# Altium project Hydra A1 UCLO 35131D.PrjPCB (part 7 of 14)

## Sheet A1-A1 Switches new.SchDoc: A1-A1 Switches new
size D; DrawnBy: C. Lewis; Engineer: C. Lewis; Address1: 4650 NORRIS CANYON RD.; Address2: SAN RAMON, CA 94583; DocumentNumber: 35133; Revision: D; SheetNumber: 2; SheetTotal: 20
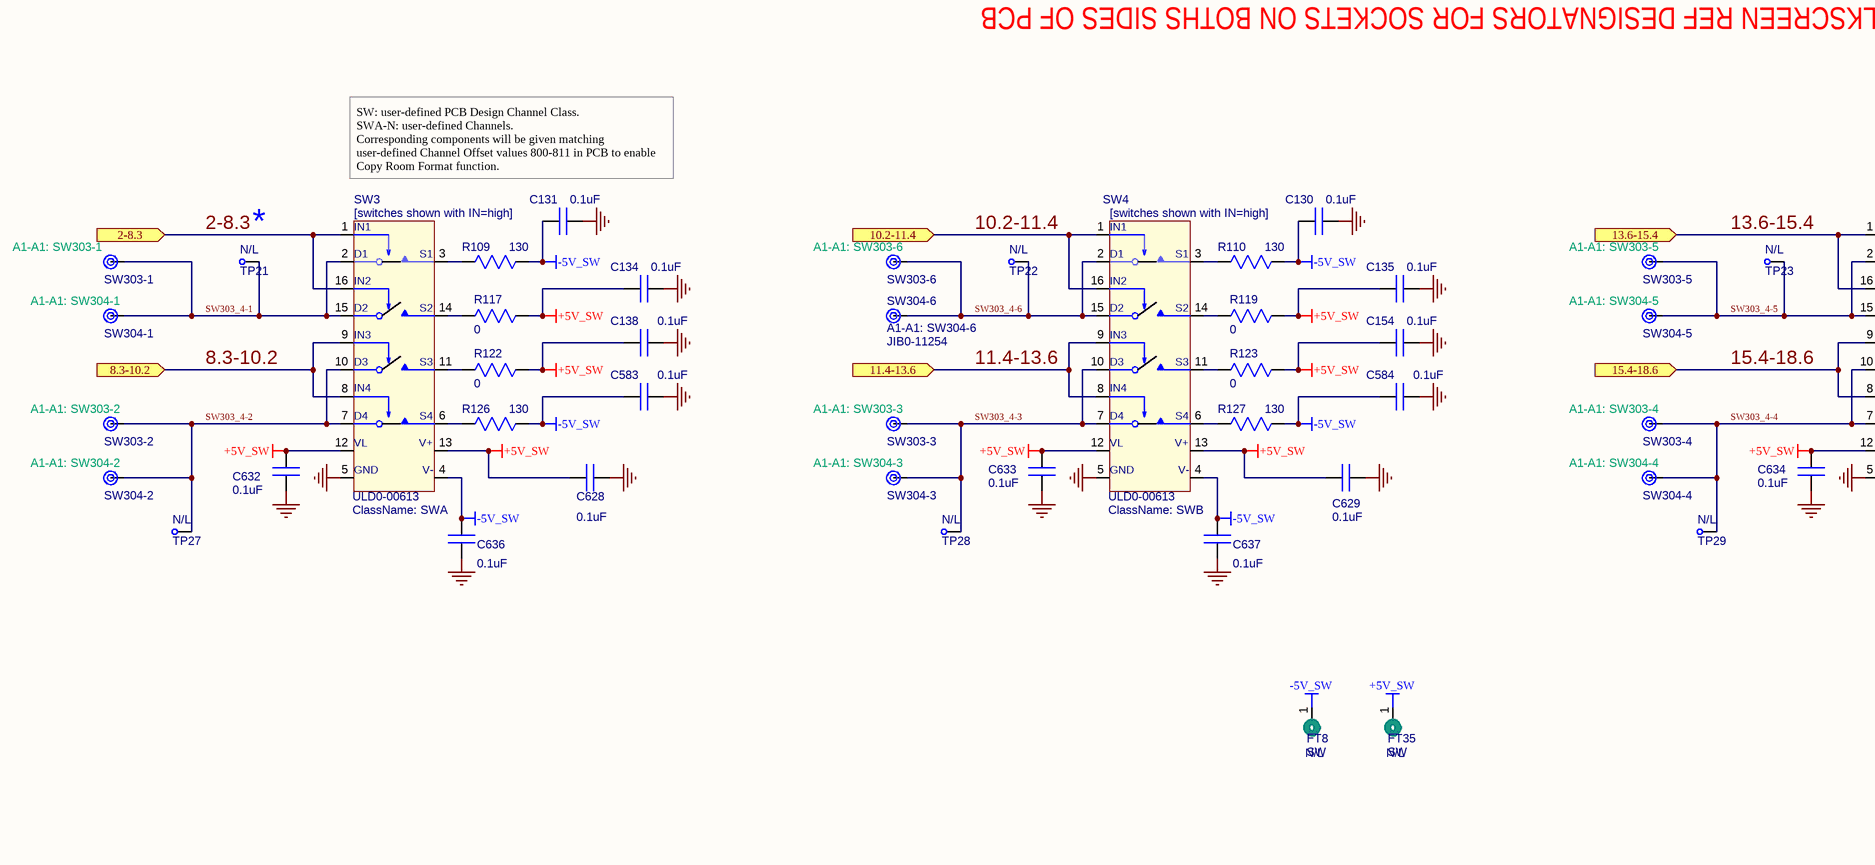
[diagram p33: A1-A1 Switches new.SchDoc, top left]
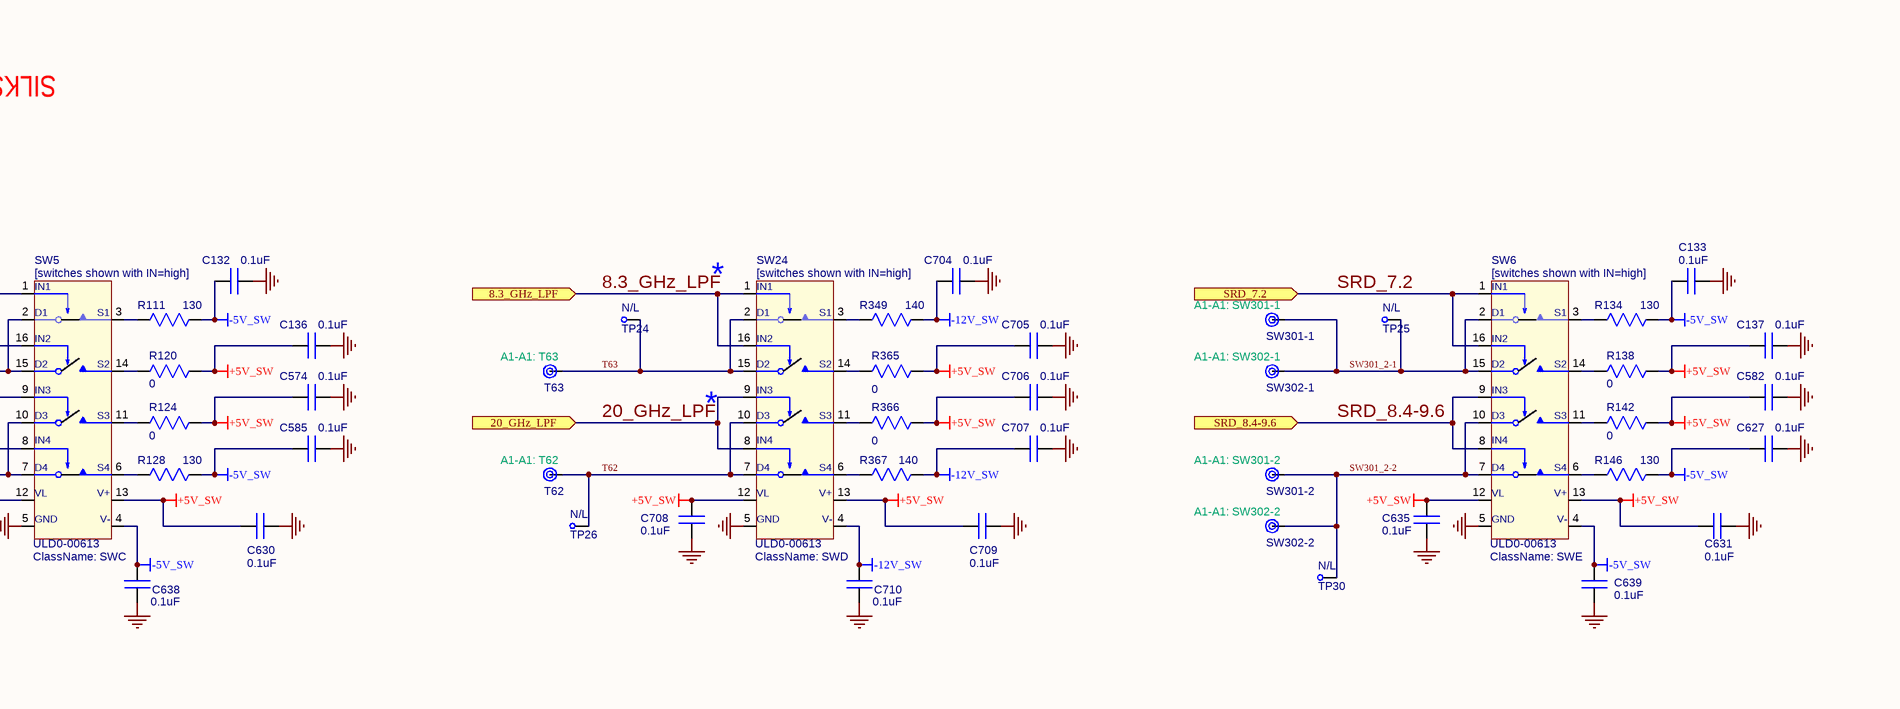
[diagram p34: A1-A1 Switches new.SchDoc, top right]
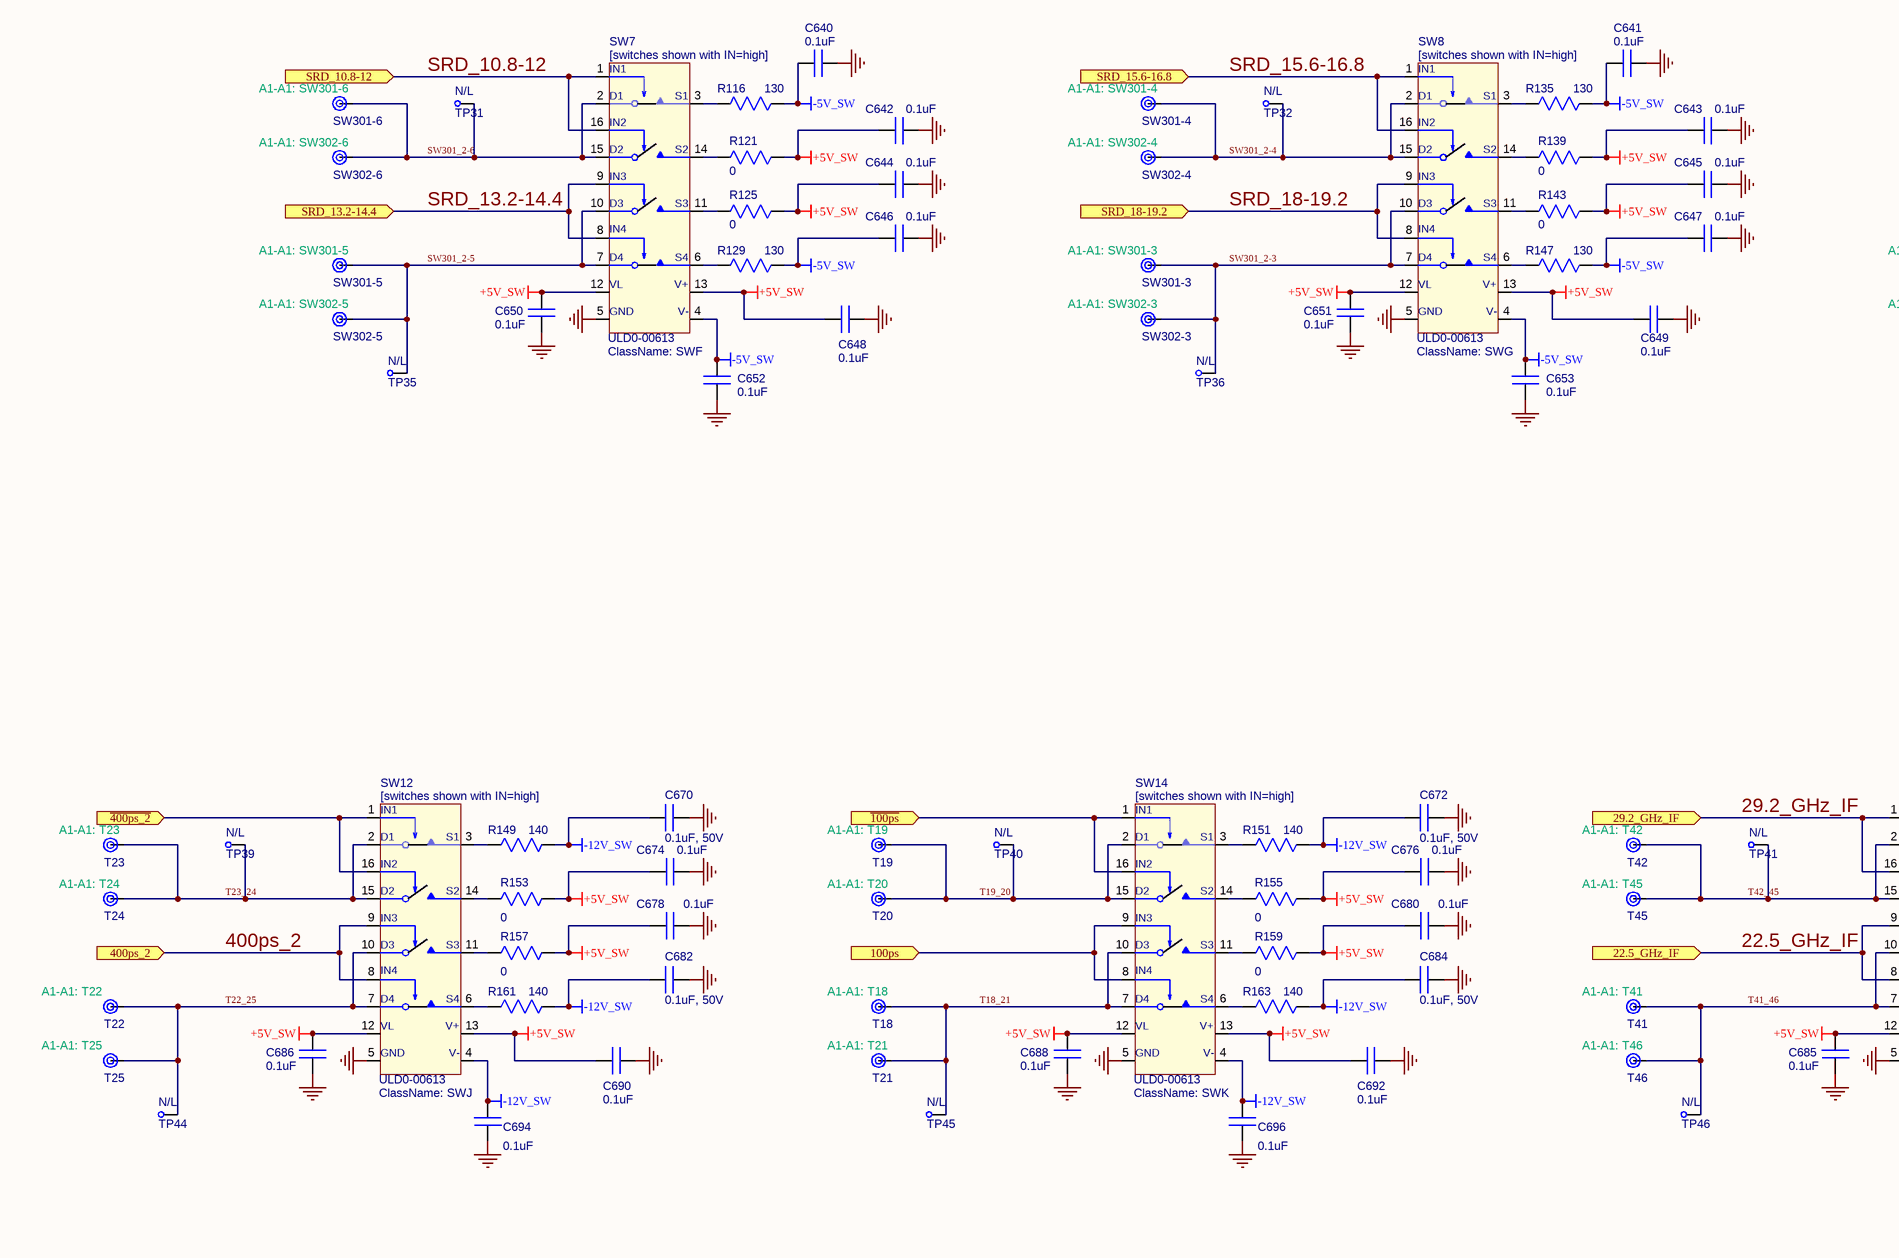
[diagram p35: A1-A1 Switches new.SchDoc, bottom left]
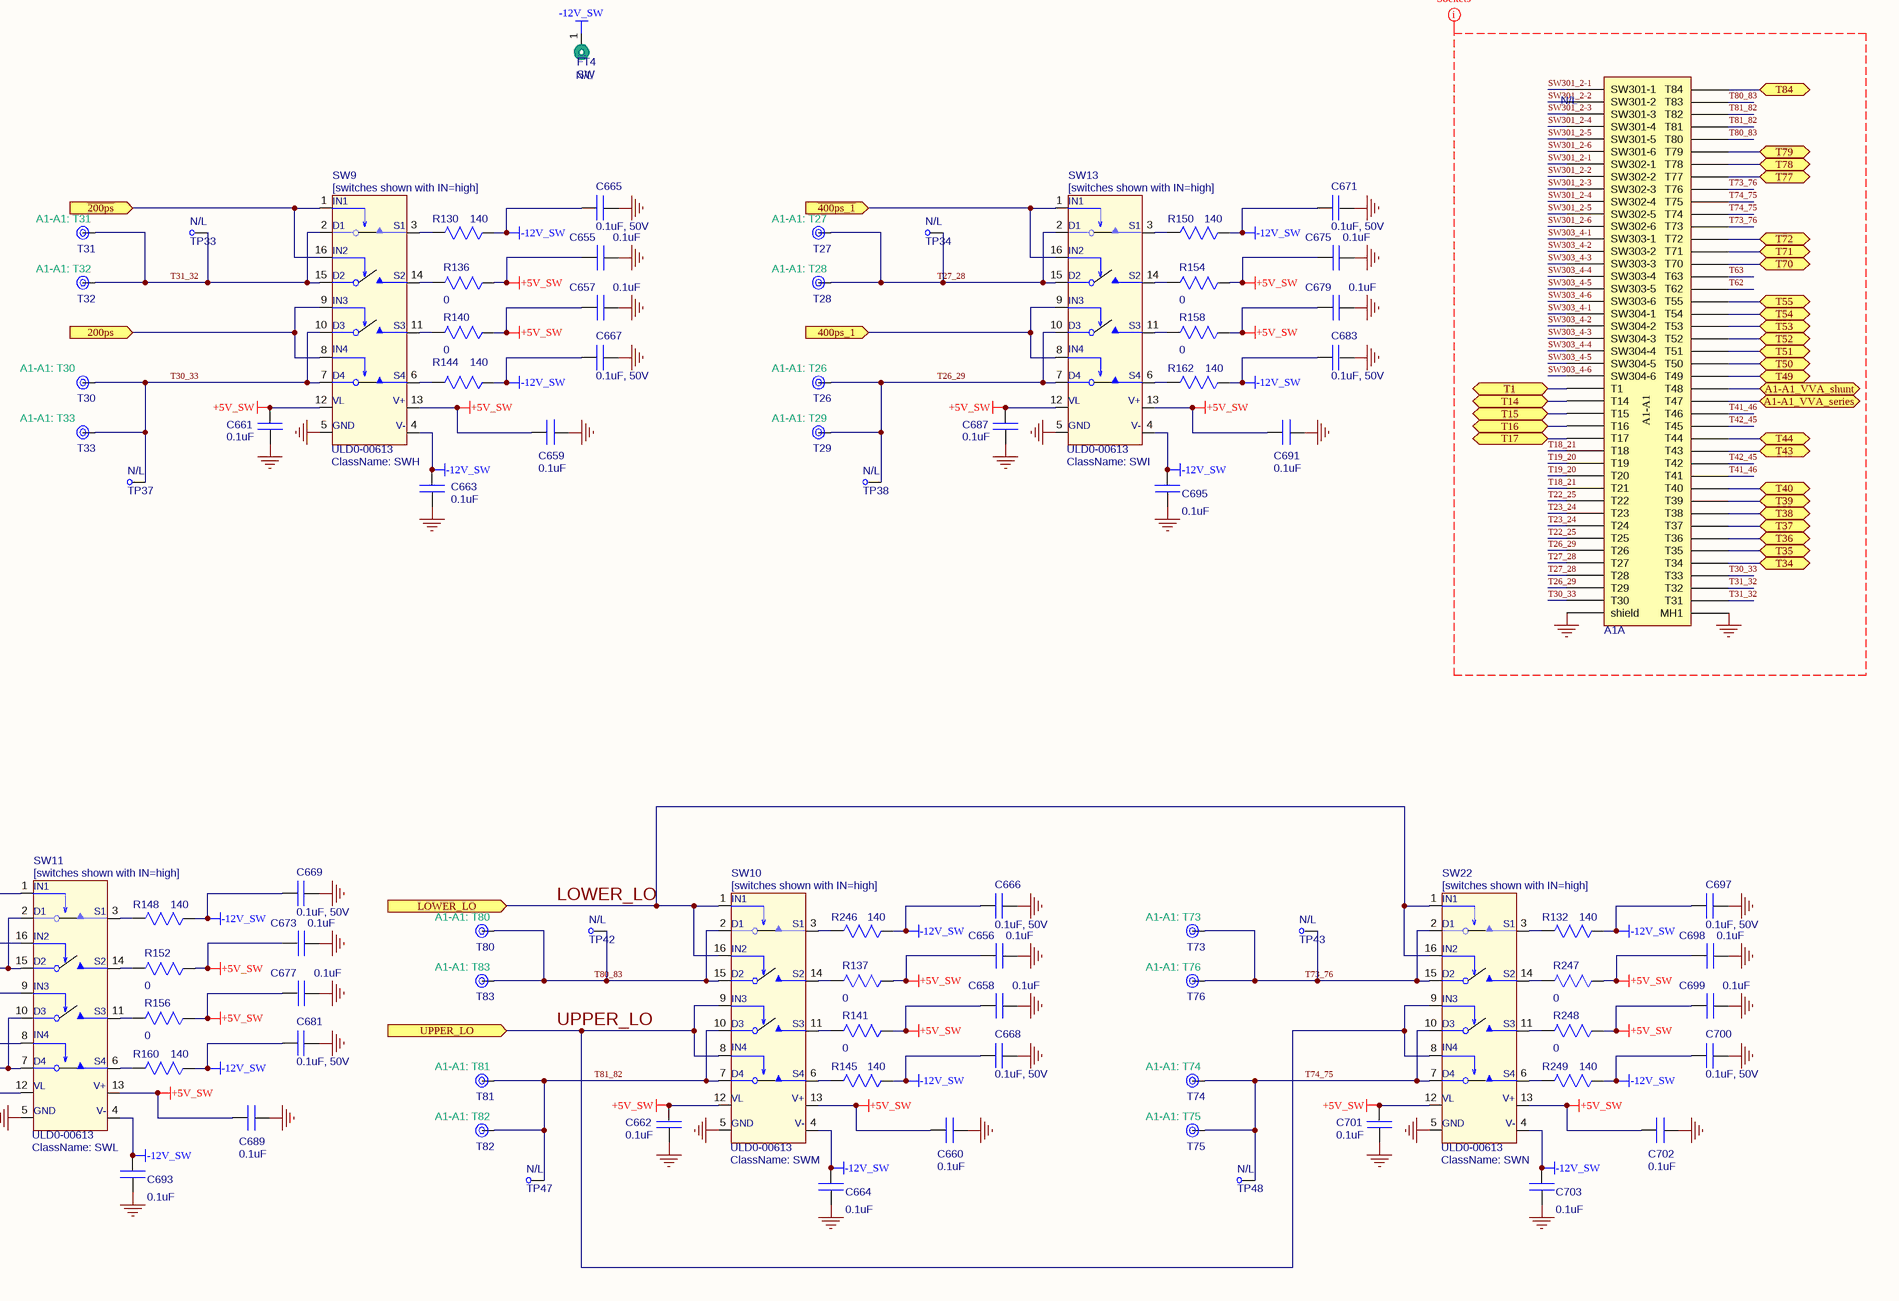
[diagram p36: A1-A1 Switches new.SchDoc, bottom right]

### Parts
A1  NoLoad: N/L  [Hydra_A1_output_modules]  (hidden comment: PCB features)  (part A of 2)
C130  value 0.1uF  [CAP-0402-N]  (hidden comment: .1 UF,10%;X7R;16V,CHIP;0402)
C131  value 0.1uF  [CAP-0402-N]  (hidden comment: .1 UF,10%;X7R;16V,CHIP;0402)
C132  value 0.1uF  [CAP-0402-N]  (hidden comment: .1 UF,10%;X7R;16V,CHIP;0402)
C133  value 0.1uF  [CAP-0402-N]  (hidden comment: .1 UF,10%;X7R;16V,CHIP;0402)
C134  value 0.1uF  [CAP-0402-N]  (hidden comment: .1 UF,10%;X7R;16V,CHIP;0402)
C135  value 0.1uF  [CAP-0402-N]  (hidden comment: .1 UF,10%;X7R;16V,CHIP;0402)
C136  value 0.1uF  [CAP-0402-N]  (hidden comment: .1 UF,10%;X7R;16V,CHIP;0402)
C137  value 0.1uF  [CAP-0402-N]  (hidden comment: .1 UF,10%;X7R;16V,CHIP;0402)
C138  value 0.1uF  [CAP-0402-N]  (hidden comment: .1 UF,10%;X7R;16V,CHIP;0402)
C154  value 0.1uF  [CAP-0402-N]  (hidden comment: .1 UF,10%;X7R;16V,CHIP;0402)
C574  value 0.1uF  [CAP-0402-N]  (hidden comment: .1 UF,10%;X7R;16V,CHIP;0402)
C582  value 0.1uF  [CAP-0402-N]  (hidden comment: .1 UF,10%;X7R;16V,CHIP;0402)
C583  value 0.1uF  [CAP-0402-N]  (hidden comment: .1 UF,10%;X7R;16V,CHIP;0402)
C584  value 0.1uF  [CAP-0402-N]  (hidden comment: .1 UF,10%;X7R;16V,CHIP;0402)
C585  value 0.1uF  [CAP-0402-N]  (hidden comment: .1 UF,10%;X7R;16V,CHIP;0402)
C627  value 0.1uF  [CAP-0402-N]  (hidden comment: .1 UF,10%;X7R;16V,CHIP;0402)
C628  value 0.1uF  [CAP-0402-N]  (hidden comment: .1 UF,10%;X7R;16V,CHIP;0402)
C629  value 0.1uF  [CAP-0402-N]  (hidden comment: .1 UF,10%;X7R;16V,CHIP;0402)
C630  value 0.1uF  [CAP-0402-N]  (hidden comment: .1 UF,10%;X7R;16V,CHIP;0402)
C631  value 0.1uF  [CAP-0402-N]  (hidden comment: .1 UF,10%;X7R;16V,CHIP;0402)
C632  value 0.1uF  [CAP-0402-N]  (hidden comment: .1 UF,10%;X7R;16V,CHIP;0402)
C633  value 0.1uF  [CAP-0402-N]  (hidden comment: .1 UF,10%;X7R;16V,CHIP;0402)
C634  value 0.1uF  [CAP-0402-N]  (hidden comment: .1 UF,10%;X7R;16V,CHIP;0402)
C635  value 0.1uF  [CAP-0402-N]  (hidden comment: .1 UF,10%;X7R;16V,CHIP;0402)
C636  value 0.1uF  [CAP-0402-N]  (hidden comment: .1 UF,10%;X7R;16V,CHIP;0402)
C637  value 0.1uF  [CAP-0402-N]  (hidden comment: .1 UF,10%;X7R;16V,CHIP;0402)
C638  value 0.1uF  [CAP-0402-N]  (hidden comment: .1 UF,10%;X7R;16V,CHIP;0402)
C639  value 0.1uF  [CAP-0402-N]  (hidden comment: .1 UF,10%;X7R;16V,CHIP;0402)
C640  value 0.1uF  [CAP-0402-N]  (hidden comment: .1 UF,10%;X7R;16V,CHIP;0402)
C641  value 0.1uF  [CAP-0402-N]  (hidden comment: .1 UF,10%;X7R;16V,CHIP;0402)
C642  value 0.1uF  [CAP-0402-N]  (hidden comment: .1 UF,10%;X7R;16V,CHIP;0402)
C643  value 0.1uF  [CAP-0402-N]  (hidden comment: .1 UF,10%;X7R;16V,CHIP;0402)
C644  value 0.1uF  [CAP-0402-N]  (hidden comment: .1 UF,10%;X7R;16V,CHIP;0402)
C645  value 0.1uF  [CAP-0402-N]  (hidden comment: .1 UF,10%;X7R;16V,CHIP;0402)
C646  value 0.1uF  [CAP-0402-N]  (hidden comment: .1 UF,10%;X7R;16V,CHIP;0402)
C647  value 0.1uF  [CAP-0402-N]  (hidden comment: .1 UF,10%;X7R;16V,CHIP;0402)
C648  value 0.1uF  [CAP-0402-N]  (hidden comment: .1 UF,10%;X7R;16V,CHIP;0402)
C649  value 0.1uF  [CAP-0402-N]  (hidden comment: .1 UF,10%;X7R;16V,CHIP;0402)
C650  value 0.1uF  [CAP-0402-N]  (hidden comment: .1 UF,10%;X7R;16V,CHIP;0402)
C651  value 0.1uF  [CAP-0402-N]  (hidden comment: .1 UF,10%;X7R;16V,CHIP;0402)
C652  value 0.1uF  [CAP-0402-N]  (hidden comment: .1 UF,10%;X7R;16V,CHIP;0402)
C653  value 0.1uF  [CAP-0402-N]  (hidden comment: .1 UF,10%;X7R;16V,CHIP;0402)
C655  value 0.1uF  [CAP-0402-N]  (hidden comment: .1 UF,10%;X7R;16V,CHIP;0402)
C656  value 0.1uF  [CAP-0402-N]  (hidden comment: .1 UF,10%;X7R;16V,CHIP;0402)
C657  value 0.1uF  [CAP-0402-N]  (hidden comment: .1 UF,10%;X7R;16V,CHIP;0402)
C658  value 0.1uF  [CAP-0402-N]  (hidden comment: .1 UF,10%;X7R;16V,CHIP;0402)
C659  value 0.1uF  [CAP-0402-N]  (hidden comment: .1 UF,10%;X7R;16V,CHIP;0402)
C660  value 0.1uF  [CAP-0402-N]  (hidden comment: .1 UF,10%;X7R;16V,CHIP;0402)
C661  value 0.1uF  [CAP-0402-N]  (hidden comment: .1 UF,10%;X7R;16V,CHIP;0402)
C662  value 0.1uF  [CAP-0402-N]  (hidden comment: .1 UF,10%;X7R;16V,CHIP;0402)
C663  value 0.1uF  [CAP-0402-N]  (hidden comment: .1 UF,10%;X7R;16V,CHIP;0402)
C664  value 0.1uF  [CAP-0402-N]  (hidden comment: .1 UF,10%;X7R;16V,CHIP;0402)
C665  value 0.1uF, 50V  [CAP-0603-N]  (hidden comment: .1UF;5%;X7R;50V;CHIP;0603)
C666  value 0.1uF, 50V  [CAP-0603-N]  (hidden comment: .1UF;5%;X7R;50V;CHIP;0603)
C667  value 0.1uF, 50V  [CAP-0603-N]  (hidden comment: .1UF;5%;X7R;50V;CHIP;0603)
C668  value 0.1uF, 50V  [CAP-0603-N]  (hidden comment: .1UF;5%;X7R;50V;CHIP;0603)
C669  value 0.1uF, 50V  [CAP-0603-N]  (hidden comment: .1UF;5%;X7R;50V;CHIP;0603)
C670  value 0.1uF, 50V  [CAP-0603-N]  (hidden comment: .1UF;5%;X7R;50V;CHIP;0603)
C671  value 0.1uF, 50V  [CAP-0603-N]  (hidden comment: .1UF;5%;X7R;50V;CHIP;0603)
C672  value 0.1uF, 50V  [CAP-0603-N]  (hidden comment: .1UF;5%;X7R;50V;CHIP;0603)
C673  value 0.1uF  [CAP-0402-N]  (hidden comment: .1 UF,10%;X7R;16V,CHIP;0402)
C674  value 0.1uF  [CAP-0402-N]  (hidden comment: .1 UF,10%;X7R;16V,CHIP;0402)
C675  value 0.1uF  [CAP-0402-N]  (hidden comment: .1 UF,10%;X7R;16V,CHIP;0402)
C676  value 0.1uF  [CAP-0402-N]  (hidden comment: .1 UF,10%;X7R;16V,CHIP;0402)
C677  value 0.1uF  [CAP-0402-N]  (hidden comment: .1 UF,10%;X7R;16V,CHIP;0402)
C678  value 0.1uF  [CAP-0402-N]  (hidden comment: .1 UF,10%;X7R;16V,CHIP;0402)
C679  value 0.1uF  [CAP-0402-N]  (hidden comment: .1 UF,10%;X7R;16V,CHIP;0402)
C680  value 0.1uF  [CAP-0402-N]  (hidden comment: .1 UF,10%;X7R;16V,CHIP;0402)
C681  value 0.1uF, 50V  [CAP-0603-N]  (hidden comment: .1UF;5%;X7R;50V;CHIP;0603)
C682  value 0.1uF, 50V  [CAP-0603-N]  (hidden comment: .1UF;5%;X7R;50V;CHIP;0603)
C683  value 0.1uF, 50V  [CAP-0603-N]  (hidden comment: .1UF;5%;X7R;50V;CHIP;0603)
C684  value 0.1uF, 50V  [CAP-0603-N]  (hidden comment: .1UF;5%;X7R;50V;CHIP;0603)
C685  value 0.1uF  [CAP-0402-N]  (hidden comment: .1 UF,10%;X7R;16V,CHIP;0402)
C686  value 0.1uF  [CAP-0402-N]  (hidden comment: .1 UF,10%;X7R;16V,CHIP;0402)
C687  value 0.1uF  [CAP-0402-N]  (hidden comment: .1 UF,10%;X7R;16V,CHIP;0402)
C688  value 0.1uF  [CAP-0402-N]  (hidden comment: .1 UF,10%;X7R;16V,CHIP;0402)
C689  value 0.1uF  [CAP-0402-N]  (hidden comment: .1 UF,10%;X7R;16V,CHIP;0402)
C690  value 0.1uF  [CAP-0402-N]  (hidden comment: .1 UF,10%;X7R;16V,CHIP;0402)
C691  value 0.1uF  [CAP-0402-N]  (hidden comment: .1 UF,10%;X7R;16V,CHIP;0402)
C692  value 0.1uF  [CAP-0402-N]  (hidden comment: .1 UF,10%;X7R;16V,CHIP;0402)
C693  value 0.1uF  [CAP-0402-N]  (hidden comment: .1 UF,10%;X7R;16V,CHIP;0402)
C694  value 0.1uF  [CAP-0402-N]  (hidden comment: .1 UF,10%;X7R;16V,CHIP;0402)
C695  value 0.1uF  [CAP-0402-N]  (hidden comment: .1 UF,10%;X7R;16V,CHIP;0402)
C696  value 0.1uF  [CAP-0402-N]  (hidden comment: .1 UF,10%;X7R;16V,CHIP;0402)
C697  value 0.1uF, 50V  [CAP-0603-N]  (hidden comment: .1UF;5%;X7R;50V;CHIP;0603)
C698  value 0.1uF  [CAP-0402-N]  (hidden comment: .1 UF,10%;X7R;16V,CHIP;0402)
C699  value 0.1uF  [CAP-0402-N]  (hidden comment: .1 UF,10%;X7R;16V,CHIP;0402)
C700  value 0.1uF, 50V  [CAP-0603-N]  (hidden comment: .1UF;5%;X7R;50V;CHIP;0603)
C701  value 0.1uF  [CAP-0402-N]  (hidden comment: .1 UF,10%;X7R;16V,CHIP;0402)
C702  value 0.1uF  [CAP-0402-N]  (hidden comment: .1 UF,10%;X7R;16V,CHIP;0402)
C703  value 0.1uF  [CAP-0402-N]  (hidden comment: .1 UF,10%;X7R;16V,CHIP;0402)
C704  value 0.1uF  [CAP-0402-N]  (hidden comment: .1 UF,10%;X7R;16V,CHIP;0402)
C705  value 0.1uF  [CAP-0402-N]  (hidden comment: .1 UF,10%;X7R;16V,CHIP;0402)
C706  value 0.1uF  [CAP-0402-N]  (hidden comment: .1 UF,10%;X7R;16V,CHIP;0402)
C707  value 0.1uF  [CAP-0402-N]  (hidden comment: .1 UF,10%;X7R;16V,CHIP;0402)
C708  value 0.1uF  [CAP-0402-N]  (hidden comment: .1 UF,10%;X7R;16V,CHIP;0402)
C709  value 0.1uF  [CAP-0402-N]  (hidden comment: .1 UF,10%;X7R;16V,CHIP;0402)
C710  value 0.1uF  [CAP-0402-N]  (hidden comment: .1 UF,10%;X7R;16V,CHIP;0402)
FT4  SW  NoLoad: N/L  [FromToNode_ML2]  (net tie, no BOM)
FT8  SW  NoLoad: N/L  [FromToNode_ML2]  (net tie, no BOM)
FT35  SW  NoLoad: N/L  [FromToNode_ML2]  (net tie, no BOM)
R109  value 130  [RES-0603-N]  (hidden comment: 130 OHMS;.1W;1%;200PPM;FILM;CHIP;0603)
R110  value 130  [RES-0603-N]  (hidden comment: 130 OHMS;.1W;1%;200PPM;FILM;CHIP;0603)
R111  value 130  [RES-0603-N]  (hidden comment: 130 OHMS;.1W;1%;200PPM;FILM;CHIP;0603)
R116  value 130  [RES-0603-N]  (hidden comment: 130 OHMS;.1W;1%;200PPM;FILM;CHIP;0603)
R117  value 0  [RES-0603-N]  (hidden comment: JUMPER;.05 OHMS MAX;1A MAX;0603)
R119  value 0  [RES-0603-N]  (hidden comment: JUMPER;.05 OHMS MAX;1A MAX;0603)
R120  value 0  [RES-0603-N]  (hidden comment: JUMPER;.05 OHMS MAX;1A MAX;0603)
R121  value 0  [RES-0603-N]  (hidden comment: JUMPER;.05 OHMS MAX;1A MAX;0603)
R122  value 0  [RES-0603-N]  (hidden comment: JUMPER;.05 OHMS MAX;1A MAX;0603)
R123  value 0  [RES-0603-N]  (hidden comment: JUMPER;.05 OHMS MAX;1A MAX;0603)
R124  value 0  [RES-0603-N]  (hidden comment: JUMPER;.05 OHMS MAX;1A MAX;0603)
R125  value 0  [RES-0603-N]  (hidden comment: JUMPER;.05 OHMS MAX;1A MAX;0603)
R126  value 130  [RES-0603-N]  (hidden comment: 130 OHMS;.1W;1%;200PPM;FILM;CHIP;0603)
R127  value 130  [RES-0603-N]  (hidden comment: 130 OHMS;.1W;1%;200PPM;FILM;CHIP;0603)
R128  value 130  [RES-0603-N]  (hidden comment: 130 OHMS;.1W;1%;200PPM;FILM;CHIP;0603)
R129  value 130  [RES-0603-N]  (hidden comment: 130 OHMS;.1W;1%;200PPM;FILM;CHIP;0603)
R130  value 140  [RES-0603-N]  (hidden comment: 140 OHMS;.1W;1%;200PPM;FILM;CHIP;0603)
R132  value 140  [RES-0402-N]  (hidden comment: 140 OHMS; 1%; .1W; 100PPM; FILM; CHIP; 0402)
R134  value 130  [RES-0603-N]  (hidden comment: 130 OHMS;.1W;1%;200PPM;FILM;CHIP;0603)
R135  value 130  [RES-0603-N]  (hidden comment: 130 OHMS;.1W;1%;200PPM;FILM;CHIP;0603)
R136  value 0  [RES-0402-N]  (hidden comment: JUMPER;0 OHMS;SMT;0402)
R137  value 0  [RES-0402-N]  (hidden comment: JUMPER;0 OHMS;SMT;0402)
R138  value 0  [RES-0603-N]  (hidden comment: JUMPER;.05 OHMS MAX;1A MAX;0603)
R139  value 0  [RES-0603-N]  (hidden comment: JUMPER;.05 OHMS MAX;1A MAX;0603)
R140  value 0  [RES-0402-N]  (hidden comment: JUMPER;0 OHMS;SMT;0402)
R141  value 0  [RES-0402-N]  (hidden comment: JUMPER;0 OHMS;SMT;0402)
R142  value 0  [RES-0603-N]  (hidden comment: JUMPER;.05 OHMS MAX;1A MAX;0603)
R143  value 0  [RES-0603-N]  (hidden comment: JUMPER;.05 OHMS MAX;1A MAX;0603)
R144  value 140  [RES-0603-N]  (hidden comment: 140 OHMS;.1W;1%;200PPM;FILM;CHIP;0603)
R145  value 140  [RES-0402-N]  (hidden comment: 140 OHMS; 1%; .1W; 100PPM; FILM; CHIP; 0402)
R146  value 130  [RES-0603-N]  (hidden comment: 130 OHMS;.1W;1%;200PPM;FILM;CHIP;0603)
R147  value 130  [RES-0603-N]  (hidden comment: 130 OHMS;.1W;1%;200PPM;FILM;CHIP;0603)
R148  value 140  [RES-0603-N]  (hidden comment: 140 OHMS;.1W;1%;200PPM;FILM;CHIP;0603)
R149  value 140  [RES-0603-N]  (hidden comment: 140 OHMS;.1W;1%;200PPM;FILM;CHIP;0603)
R150  value 140  [RES-0603-N]  (hidden comment: 140 OHMS;.1W;1%;200PPM;FILM;CHIP;0603)
R151  value 140  [RES-0603-N]  (hidden comment: 140 OHMS;.1W;1%;200PPM;FILM;CHIP;0603)
R152  value 0  [RES-0402-N]  (hidden comment: JUMPER;0 OHMS;SMT;0402)
R153  value 0  [RES-0402-N]  (hidden comment: JUMPER;0 OHMS;SMT;0402)
R154  value 0  [RES-0402-N]  (hidden comment: JUMPER;0 OHMS;SMT;0402)
R155  value 0  [RES-0402-N]  (hidden comment: JUMPER;0 OHMS;SMT;0402)
R156  value 0  [RES-0402-N]  (hidden comment: JUMPER;0 OHMS;SMT;0402)
R157  value 0  [RES-0402-N]  (hidden comment: JUMPER;0 OHMS;SMT;0402)
R158  value 0  [RES-0402-N]  (hidden comment: JUMPER;0 OHMS;SMT;0402)
R159  value 0  [RES-0402-N]  (hidden comment: JUMPER;0 OHMS;SMT;0402)
R160  value 140  [RES-0603-N]  (hidden comment: 140 OHMS;.1W;1%;200PPM;FILM;CHIP;0603)
R161  value 140  [RES-0603-N]  (hidden comment: 140 OHMS;.1W;1%;200PPM;FILM;CHIP;0603)
R162  value 140  [RES-0603-N]  (hidden comment: 140 OHMS;.1W;1%;200PPM;FILM;CHIP;0603)
R163  value 140  [RES-0603-N]  (hidden comment: 140 OHMS;.1W;1%;200PPM;FILM;CHIP;0603)
R246  value 140  [RES-0402-N]  (hidden comment: 140 OHMS; 1%; .1W; 100PPM; FILM; CHIP; 0402)
R247  value 0  [RES-0402-N]  (hidden comment: JUMPER;0 OHMS;SMT;0402)
R248  value 0  [RES-0402-N]  (hidden comment: JUMPER;0 OHMS;SMT;0402)
R249  value 140  [RES-0402-N]  (hidden comment: 140 OHMS; 1%; .1W; 100PPM; FILM; CHIP; 0402)
R349  value 140  [RES-0402-N]  (hidden comment: 140 OHMS; 1%; .1W; 100PPM; FILM; CHIP; 0402)
R365  value 0  [RES-0402-N]  (hidden comment: JUMPER;0 OHMS;SMT;0402)
R366  value 0  [RES-0402-N]  (hidden comment: JUMPER;0 OHMS;SMT;0402)
R367  value 140  [RES-0402-N]  (hidden comment: 140 OHMS; 1%; .1W; 100PPM; FILM; CHIP; 0402)
SW3  [switches shown with IN=high]  G_PN: ULD0-00613  ClassName: SWA  [SOIC-16_Vishay]
SW4  [switches shown with IN=high]  G_PN: ULD0-00613  ClassName: SWB  [SOIC-16_Vishay]
SW5  [switches shown with IN=high]  G_PN: ULD0-00613  ClassName: SWC  [SOIC-16_Vishay]
SW6  [switches shown with IN=high]  G_PN: ULD0-00613  ClassName: SWE  [SOIC-16_Vishay]
SW7  [switches shown with IN=high]  G_PN: ULD0-00613  ClassName: SWF  [SOIC-16_Vishay]
SW8  [switches shown with IN=high]  G_PN: ULD0-00613  ClassName: SWG  [SOIC-16_Vishay]
SW9  [switches shown with IN=high]  G_PN: ULD0-00613  ClassName: SWH  [SOIC-16_Vishay]
SW10  [switches shown with IN=high]  G_PN: ULD0-00613  ClassName: SWM  [SOIC-16_Vishay]
SW11  [switches shown with IN=high]  G_PN: ULD0-00613  ClassName: SWL  [SOIC-16_Vishay]
SW12  [switches shown with IN=high]  G_PN: ULD0-00613  ClassName: SWJ  [SOIC-16_Vishay]
SW13  [switches shown with IN=high]  G_PN: ULD0-00613  ClassName: SWI  [SOIC-16_Vishay]
SW14  [switches shown with IN=high]  G_PN: ULD0-00613  ClassName: SWK  [SOIC-16_Vishay]
SW22  [switches shown with IN=high]  G_PN: ULD0-00613  ClassName: SWN  [SOIC-16_Vishay]
SW24  [switches shown with IN=high]  G_PN: ULD0-00613  ClassName: SWD  [SOIC-16_Vishay]
SW301-1  A1-A1: SW301-1  [JIB0-11254]
SW301-2  A1-A1: SW301-2  [JIB0-11254]
SW301-3  A1-A1: SW301-3  [JIB0-11254]
SW301-4  A1-A1: SW301-4  [JIB0-11254]
SW301-5  A1-A1: SW301-5  [JIB0-11254]
SW301-6  A1-A1: SW301-6  [JIB0-11254]
SW302-1  A1-A1: SW302-1  [JIB0-11254]
SW302-2  A1-A1: SW302-2  [JIB0-11254]
SW302-3  A1-A1: SW302-3  [JIB0-11254]
SW302-4  A1-A1: SW302-4  [JIB0-11254]
SW302-5  A1-A1: SW302-5  [JIB0-11254]
SW302-6  A1-A1: SW302-6  [JIB0-11254]
SW303-1  A1-A1: SW303-1  [JIB0-11254]
SW303-2  A1-A1: SW303-2  [JIB0-11254]
SW303-3  A1-A1: SW303-3  [JIB0-11254]
SW303-4  A1-A1: SW303-4  [JIB0-11254]
SW303-5  A1-A1: SW303-5  [JIB0-11254]
SW303-6  A1-A1: SW303-6  [JIB0-11254]
SW304-1  A1-A1: SW304-1  [JIB0-11254]
SW304-2  A1-A1: SW304-2  [JIB0-11254]
SW304-3  A1-A1: SW304-3  [JIB0-11254]
SW304-4  A1-A1: SW304-4  [JIB0-11254]
SW304-5  A1-A1: SW304-5  [JIB0-11254]
SW304-6  A1-A1: SW304-6  G_PN: JIB0-11254  [JIB0-11254-TRIM]
T18  A1-A1: T18  [JIB0-11254]
T19  A1-A1: T19  [JIB0-11254]
T20  A1-A1: T20  [JIB0-11254]
T21  A1-A1: T21  [JIB0-11254]
T22  A1-A1: T22  [JIB0-11254]
T23  A1-A1: T23  [JIB0-11254]
T24  A1-A1: T24  [JIB0-11254]
T25  A1-A1: T25  [JIB0-11254]
T26  A1-A1: T26  [JIB0-11254]
T27  A1-A1: T27  [JIB0-11254]
T28  A1-A1: T28  [JIB0-11254]
T29  A1-A1: T29  [JIB0-11254]
T30  A1-A1: T30  [JIB0-11254]
T31  A1-A1: T31  [JIB0-11254]
T32  A1-A1: T32  [JIB0-11254]
T33  A1-A1: T33  [JIB0-11254]
T41  A1-A1: T41  [JIB0-11254]
T42  A1-A1: T42  [JIB0-11254]
T45  A1-A1: T45  [JIB0-11254]
T46  A1-A1: T46  [JIB0-11254]
T62  A1-A1: T62  [JIB0-11254]
T63  A1-A1: T63  [JIB0-11254]
T73  A1-A1: T73  [JIB0-11254]
T74  A1-A1: T74  [JIB0-11254]
T75  A1-A1: T75  [JIB0-11254]
T76  A1-A1: T76  [JIB0-11254]
T80  A1-A1: T80  [JIB0-11254]
T81  A1-A1: T81  [JIB0-11254]
T82  A1-A1: T82  [JIB0-11254]
T83  A1-A1: T83  [JIB0-11254]
TP21  NoLoad: N/L  [TP-060]  (hidden comment: .)
TP22  NoLoad: N/L  [TP-060]  (hidden comment: .)
TP23  NoLoad: N/L  [TP-060]  (hidden comment: .)
TP24  NoLoad: N/L  [TP-060]  (hidden comment: .)
TP25  NoLoad: N/L  [TP-060]  (hidden comment: .)
TP26  NoLoad: N/L  [TP-060]  (hidden comment: .)
TP27  NoLoad: N/L  [TP-060]  (hidden comment: .)
TP28  NoLoad: N/L  [TP-060]  (hidden comment: .)
TP29  NoLoad: N/L  [TP-060]  (hidden comment: .)
TP30  NoLoad: N/L  [TP-060]  (hidden comment: .)
TP31  NoLoad: N/L  [TP-060]  (hidden comment: .)
TP32  NoLoad: N/L  [TP-060]  (hidden comment: .)
TP33  NoLoad: N/L  [TP-060]  (hidden comment: .)
TP34  NoLoad: N/L  [TP-060]  (hidden comment: .)
TP35  NoLoad: N/L  [TP-060]  (hidden comment: .)
TP36  NoLoad: N/L  [TP-060]  (hidden comment: .)
TP37  NoLoad: N/L  [TP-060]  (hidden comment: .)
TP38  NoLoad: N/L  [TP-060]  (hidden comment: .)
TP39  NoLoad: N/L  [TP-060]  (hidden comment: .)
TP40  NoLoad: N/L  [TP-060]  (hidden comment: .)
TP41  NoLoad: N/L  [TP-060]  (hidden comment: .)
TP42  NoLoad: N/L  [TP-060]  (hidden comment: .)
TP43  NoLoad: N/L  [TP-060]  (hidden comment: .)
TP44  NoLoad: N/L  [TP-060]  (hidden comment: .)
TP45  NoLoad: N/L  [TP-060]  (hidden comment: .)
TP46  NoLoad: N/L  [TP-060]  (hidden comment: .)
TP47  NoLoad: N/L  [TP-060]  (hidden comment: .)
TP48  NoLoad: N/L  [TP-060]  (hidden comment: .)

### Ports
2-8.3, 8.3-10.2, 8.3_GHz_LPF, 10.2-11.4, 11.4-13.6, 13.6-15.4, 15.4-18.6, 20_GHz_LPF, 22.5_GHz_IF, 29.2_GHz_IF, 100ps, 200ps, 400ps_1, 400ps_2, A1-A1_VVA_series, A1-A1_VVA_shunt, LOWER_LO, SRD_7.2, SRD_8.4-9.6, SRD_10.8-12, SRD_13.2-14.4, SRD_15.6-16.8, SRD_18-19.2, T1, T14, T15, T16, T17, T34, T35, T36, T37, T38, T39, T40, T43, T44, T49, T50, T51, T52, T53, T54, T55, T70, T71, T72, T77, T78, T79, T84, UPPER_LO, ~{100ps}, ~{200ps}, ~{400ps_1}, ~{400ps_2}

### Nets
+5V_SW: C134.2 C135.2 C136.2 C137.2 C138.2 C154.2 C574.2 C582.2 C628.2 C629.2 C630.2 C631.2 C632.2 C633.2 C634.2 C635.2 C642.2 C643.2 C644.2 C645.2 C648.2 C649.2 C650.2 C651.2 C655.2 C656.2 C657.2 C658.2 C659.2 C660.2 C661.2 C662.2 C673.2 C674.2 C675.2 C676.2 C677.2 C678.2 C679.2 C680.2 C685.2 C686.2 C687.2 C688.2 C689.2 C690.2 C691.2 C692.2 C698.2 C699.2 C701.2 C702.2 C705.2 C706.2 C708.2 C709.2 FT35.1 R117.2 R119.2 R120.2 R121.2 R122.2 R123.2 R124.2 R125.2 R136.2 R137.2 R138.2 R139.2 R140.2 R141.2 R142.2 R143.2 R152.2 R153.2 R154.2 R155.2 R156.2 R157.2 R158.2 R159.2 R247.2 R248.2 R365.2 R366.2 SW3.12(VL) SW3.13(V+) SW4.12(VL) SW4.13(V+) SW5.12(VL) SW5.13(V+) SW6.12(VL) SW6.13(V+) SW7.12(VL) SW7.13(V+) SW8.12(VL) SW8.13(V+) SW9.12(VL) SW9.13(V+) SW10.12(VL) SW10.13(V+) SW11.12(VL) SW11.13(V+) SW12.12(VL) SW12.13(V+) SW13.12(VL) SW13.13(V+) SW14.12(VL) SW14.13(V+) SW22.12(VL) SW22.13(V+) SW24.12(VL) SW24.13(V+)
-5V_SW: C130.2 C131.2 C132.2 C133.2 C583.2 C584.2 C585.2 C627.2 C636.2 C637.2 C638.2 C639.2 C640.2 C641.2 C646.2 C647.2 C652.2 C653.2 FT8.1 R109.2 R110.2 R111.2 R116.2 R126.2 R127.2 R128.2 R129.2 R134.2 R135.2 R146.2 R147.2 SW3.4(VL) SW4.4(VL) SW5.4(VL) SW6.4(VL) SW7.4(VL) SW8.4(VL)
-12V_SW: C663.2 C664.2 C665.1 C666.1 C667.1 C668.1 C669.1 C670.1 C671.1 C672.1 C681.1 C682.1 C683.1 C684.1 C693.2 C694.2 C695.2 C696.2 C697.1 C700.1 C703.2 C704.2 C707.2 C710.2 FT4.1 R130.2 R132.2 R144.2 R145.2 R148.2 R149.2 R150.2 R151.2 R160.2 R161.2 R162.2 R163.2 R246.2 R249.2 R349.2 R367.2 SW9.4(VL) SW10.4(VL) SW11.4(VL) SW12.4(VL) SW13.4(VL) SW14.4(VL) SW22.4(VL) SW24.4(VL)
GND: A1.A1-A1_shield(shield) A1.MH1 C130.1 C131.1 C132.1 C133.1 C134.1 C135.1 C136.1 C137.1 C138.1 C154.1 C574.1 C582.1 C583.1 C584.1 C585.1 C627.1 C628.1 C629.1 C630.1 C631.1 C632.1 C633.1 C634.1 C635.1 C636.1 C637.1 C638.1 C639.1 C640.1 C641.1 C642.1 C643.1 C644.1 C645.1 C646.1 C647.1 C648.1 C649.1 C650.1 C651.1 C652.1 C653.1 C655.1 C656.1 C657.1 C658.1 C659.1 C660.1 C661.1 C662.1 C663.1 C664.1 C665.2 C666.2 C667.2 C668.2 C669.2 C670.2 C671.2 C672.2 C673.1 C674.1 C675.1 C676.1 C677.1 C678.1 C679.1 C680.1 C681.2 C682.2 C683.2 C684.2 C685.1 C686.1 C687.1 C688.1 C689.1 C690.1 C691.1 C692.1 C693.1 C694.1 C695.1 C696.1 C697.2 C698.1 C699.1 C700.2 C701.1 C702.1 C703.1 C704.1 C705.1 C706.1 C707.1 C708.1 C709.1 C710.1 SW3.5(IN2) SW4.5(IN2) SW5.5(IN2) SW6.5(IN2) SW7.5(IN2) SW8.5(IN2) SW9.5(IN2) SW10.5(IN2) SW11.5(IN2) SW12.5(IN2) SW13.5(IN2) SW14.5(IN2) SW22.5(IN2) SW24.5(IN2)
~{100ps}: SW14.1(IN1) SW14.16(S1) ; port ~{100ps}
2-8.3: SW3.1(IN1) SW3.16(S1) ; port 2-8.3
~{200ps}: SW9.1(IN1) SW9.16(S1) ; port ~{200ps}
~{400ps_1}: SW13.1(IN1) SW13.16(S1) ; port ~{400ps_1}
~{400ps_2}: SW12.1(IN1) SW12.16(S1) ; port ~{400ps_2}
8.3-10.2: SW3.8(IN4) SW3.9(IN3) ; port 8.3-10.2
8.3_GHz_LPF: SW24.1(IN1) SW24.16(S1) ; port 8.3_GHz_LPF
10.2-11.4: SW4.1(IN1) SW4.16(S1) ; port 10.2-11.4
11.4-13.6: SW4.8(IN4) SW4.9(IN3) ; port 11.4-13.6
13.6-15.4: SW5.1(IN1) SW5.16(S1) ; port 13.6-15.4
15.4-18.6: SW5.8(IN4) SW5.9(IN3) ; port 15.4-18.6
20_GHz_LPF: SW24.8(IN4) SW24.9(IN3) ; port 20_GHz_LPF
22.5_GHz_IF: SW11.8(IN4) SW11.9(IN3) ; port 22.5_GHz_IF
29.2_GHz_IF: SW11.1(IN1) SW11.16(S1) ; port 29.2_GHz_IF
400ps_2: SW12.8(IN4) SW12.9(IN3) ; port 400ps_2
LOWER_LO: SW10.1(IN1) SW10.16(S1) SW22.1(IN1) SW22.16(S1) ; port LOWER_LO
SRD_7.2: SW6.1(IN1) SW6.16(S1) ; port SRD_7.2
SRD_8.4-9.6: SW6.8(IN4) SW6.9(IN3) ; port SRD_8.4-9.6
SRD_10.8-12: SW7.1(IN1) SW7.16(S1) ; port SRD_10.8-12
SRD_13.2-14.4: SW7.8(IN4) SW7.9(IN3) ; port SRD_13.2-14.4
SRD_15.6-16.8: SW8.1(IN1) SW8.16(S1) ; port SRD_15.6-16.8
SRD_18-19.2: SW8.8(IN4) SW8.9(IN3) ; port SRD_18-19.2
SW301_2-1: A1.SW301-1 A1.SW302-1 SW6.2(D1) SW6.15(D2) SW301-1.1 SW302-1.1 TP25.1
SW301_2-2: A1.SW301-2 A1.SW302-2 SW6.7(D4) SW6.10(D3) SW301-2.1 SW302-2.1 TP30.1
SW301_2-3: A1.SW301-3 A1.SW302-3 SW8.7(D4) SW8.10(D3) SW301-3.1 SW302-3.1 TP36.1
SW301_2-4: A1.SW301-4 A1.SW302-4 SW8.2(D1) SW8.15(D2) SW301-4.1 SW302-4.1 TP32.1
SW301_2-5: A1.SW301-5 A1.SW302-5 SW7.7(D4) SW7.10(D3) SW301-5.1 SW302-5.1 TP35.1
SW301_2-6: A1.SW301-6 A1.SW302-6 SW7.2(D1) SW7.15(D2) SW301-6.1 SW302-6.1 TP31.1
SW303_4-1: A1.SW303-1 A1.SW304-1 SW3.2(D1) SW3.15(D2) SW303-1.1 SW304-1.1 TP21.1
SW303_4-2: A1.SW303-2 A1.SW304-2 SW3.7(D4) SW3.10(D3) SW303-2.1 SW304-2.1 TP27.1
SW303_4-3: A1.SW303-3 A1.SW304-3 SW4.7(D4) SW4.10(D3) SW303-3.1 SW304-3.1 TP28.1
SW303_4-4: A1.SW303-4 A1.SW304-4 SW5.7(D4) SW5.10(D3) SW303-4.1 SW304-4.1 TP29.1
SW303_4-5: A1.SW303-5 A1.SW304-5 SW5.2(D1) SW5.15(D2) SW303-5.1 SW304-5.1 TP23.1
SW303_4-6: A1.SW303-6 A1.SW304-6 SW4.2(D1) SW4.15(D2) SW303-6.1 SW304-6.1 TP22.1
T1: A1.T1 ; port T1
T14: A1.T14 ; port T14
T15: A1.T15 ; port T15
T16: A1.T16 ; port T16
T17: A1.T17 ; port T17
T18_21: A1.T18 A1.T21 SW14.7(D4) SW14.10(D3) T18.1 T21.1 TP45.1
T19_20: A1.T19 A1.T20 SW14.2(D1) SW14.15(D2) T19.1 T20.1 TP40.1
T22_25: A1.T22 A1.T25 SW12.7(D4) SW12.10(D3) T22.1 T25.1 TP44.1
T23_24: A1.T23 A1.T24 SW12.2(D1) SW12.15(D2) T23.1 T24.1 TP39.1
T26_29: A1.T26 A1.T29 SW13.7(D4) SW13.10(D3) T26.1 T29.1 TP38.1
T27_28: A1.T27 A1.T28 SW13.2(D1) SW13.15(D2) T27.1 T28.1 TP34.1
T30_33: A1.T30 A1.T33 SW9.7(D4) SW9.10(D3) T30.1 T33.1 TP37.1
T31_32: A1.T31 A1.T32 SW9.2(D1) SW9.15(D2) T31.1 T32.1 TP33.1
T34: A1.T34 ; port T34
T35: A1.T35 ; port T35
T36: A1.T36 ; port T36
T37: A1.T37 ; port T37
T38: A1.T38 ; port T38
T39: A1.T39 ; port T39
T40: A1.T40 ; port T40
T41_46: A1.T41 A1.T46 SW11.7(D4) SW11.10(D3) T41.1 T46.1 TP46.1
T42_45: A1.T42 A1.T45 SW11.2(D1) SW11.15(D2) T42.1 T45.1 TP41.1
T43: A1.T43 ; port T43
T44: A1.T44 ; port T44
T49: A1.T49 ; port T49
T50: A1.T50 ; port T50
T53: A1.T53 ; port T53
T54: A1.T54 ; port T54
T55: A1.T55 ; port T55
T62: A1.T62 SW24.7(D4) SW24.10(D3) T62.1 TP26.1
T63: A1.T63 SW24.2(D1) SW24.15(D2) T63.1 TP24.1
T70: A1.T70 ; port T70
T71: A1.T71 ; port T71
T72: A1.T72 ; port T72
T73_76: A1.T73 A1.T76 SW22.2(D1) SW22.15(D2) T73.1 T76.1 TP43.1
T74_75: A1.T74 A1.T75 SW22.7(D4) SW22.10(D3) T74.1 T75.1 TP48.1
T77: A1.T77 ; port T77
T78: A1.T78 ; port T78
T79: A1.T79 ; port T79
T80_83: A1.T80 A1.T83 SW10.2(D1) SW10.15(D2) T80.1 T83.1 TP42.1
T81_82: A1.T81 A1.T82 SW10.7(D4) SW10.10(D3) T81.1 T82.1 TP47.1
T84: A1.T84 ; port T84
UPPER_LO: SW10.8(IN4) SW10.9(IN3) SW22.8(IN4) SW22.9(IN3) ; port UPPER_LO
NetA1_T47: A1.T47 ; port A1-A1_VVA_series
NetA1_T48: A1.T48 ; port A1-A1_VVA_shunt
NetA1_T51: A1.T51 ; port T51
NetA1_T52: A1.T52 ; port T52
NetR109_1: R109.1 SW3.3(S1)
NetR110_1: R110.1 SW4.3(S1)
NetR111_1: R111.1 SW5.3(S1)
NetR116_1: R116.1 SW7.3(S1)
NetR117_1: R117.1 SW3.14(S2)
NetR119_1: R119.1 SW4.14(S2)
NetR120_1: R120.1 SW5.14(S2)
NetR121_1: R121.1 SW7.14(S2)
NetR122_1: R122.1 SW3.11(S3)
NetR123_1: R123.1 SW4.11(S3)
NetR124_1: R124.1 SW5.11(S3)
NetR125_1: R125.1 SW7.11(S3)
NetR126_1: R126.1 SW3.6(S4)
NetR127_1: R127.1 SW4.6(S4)
NetR128_1: R128.1 SW5.6(S4)
NetR129_1: R129.1 SW7.6(S4)
NetR130_1: R130.1 SW9.3(S1)
NetR132_1: R132.1 SW22.3(S1)
NetR134_1: R134.1 SW6.3(S1)
NetR135_1: R135.1 SW8.3(S1)
NetR136_1: R136.1 SW9.14(S2)
NetR137_1: R137.1 SW10.14(S2)
NetR138_1: R138.1 SW6.14(S2)
NetR139_1: R139.1 SW8.14(S2)
NetR140_1: R140.1 SW9.11(S3)
NetR141_1: R141.1 SW10.11(S3)
NetR142_1: R142.1 SW6.11(S3)
NetR143_1: R143.1 SW8.11(S3)
NetR144_1: R144.1 SW9.6(S4)
NetR145_1: R145.1 SW10.6(S4)
NetR146_1: R146.1 SW6.6(S4)
NetR147_1: R147.1 SW8.6(S4)
NetR148_1: R148.1 SW11.3(S1)
NetR149_1: R149.1 SW12.3(S1)
NetR150_1: R150.1 SW13.3(S1)
NetR151_1: R151.1 SW14.3(S1)
NetR152_1: R152.1 SW11.14(S2)
NetR153_1: R153.1 SW12.14(S2)
NetR154_1: R154.1 SW13.14(S2)
NetR155_1: R155.1 SW14.14(S2)
NetR156_1: R156.1 SW11.11(S3)
NetR157_1: R157.1 SW12.11(S3)
NetR158_1: R158.1 SW13.11(S3)
NetR159_1: R159.1 SW14.11(S3)
NetR160_1: R160.1 SW11.6(S4)
NetR161_1: R161.1 SW12.6(S4)
NetR162_1: R162.1 SW13.6(S4)
NetR163_1: R163.1 SW14.6(S4)
NetR246_1: R246.1 SW10.3(S1)
NetR247_1: R247.1 SW22.14(S2)
NetR248_1: R248.1 SW22.11(S3)
NetR249_1: R249.1 SW22.6(S4)
NetR349_1: R349.1 SW24.3(S1)
NetR365_1: R365.1 SW24.14(S2)
NetR366_1: R366.1 SW24.11(S3)
NetR367_1: R367.1 SW24.6(S4)
NetR507_2: SW14.8(IN4) SW14.9(IN3) ; port 100ps
NetR508_2: SW9.8(IN4) SW9.9(IN3) ; port 200ps
NetR509_2: SW13.8(IN4) SW13.9(IN3) ; port 400ps_1

### Layout directives
net class Sockets: GND, SW301_2-1, SW301_2-2, SW301_2-3, SW301_2-4, SW301_2-5, SW301_2-6, SW303_4-1, SW303_4-2, SW303_4-3, SW303_4-4, SW303_4-5, SW303_4-6, T18_21, T19_20, T22_25, T23_24, T26_29, T27_28, T30_33, T31_32, T41_46, T42_45, T62, T63, T73_76, T74_75, T80_83, T81_82

### Notes on the sheet
- SILKSCREEN REF DESIGNATORS FOR SOCKETS ON BOTHS SIDES OF PCB
- SW: user-defined PCB Design Channel Class.
  SWA-N: user-defined Channels.
  Corresponding components will be given matching user-defined Channel Offset values 800-811 in PCB to enable Copy Room Format function.
- (near TP21) *
- (near SW24) *
- Title
- Sheet Title
- PRINTED DOCUMENT IS CONSIDERED UNCONTROLLED. VERIFY REVISION IN PLM SYSTEM.
- THIS DOCUMENT CONTAINS PROPRIETARY INFORMATION. DESIGN RIGHTS BELONG TO GIGA-TRONICS AND MAY NOT BE REPRODUCED WITHOUT WRITTEN AUTHORIZATION FOR ANY REASON EXCEPT CALIBRATION, OPERATION AND MAINTENANCE.
- Size
- CAGE CODE
- Filename
- D
- Document Number
- 58900
- Date
- Sheet
- Rev
- of
- (in symbol Hydra A1 output modules, part A) A1-A1
- (in symbol ULD0-00613_1) GND; V-

### Library data of the parts
A1 = Hydra A1 output modules: Hydra A1 output modules (PCB features); G_PN: 35123-35127; level: 1; Approved: *; MFGR: *; Value: *; item_number: 35123-35127
C130-C138 C154 C574 C582-C585 C627-C653 C655-C664 C673-C680 C685-C696 C698 C699 C701-C710 = CK40-04100: Approved: CL; NoLoad: .; MFGR: VENKEL; M_PN: C0402X7R160-104KNP; level: 1; line_number: 95; ModifyDate: 3/29/13; G_PN: CK40-04100; item_number: CK40-04100
  C130 C135 C154 C584 C629 C633 C637: ClassName: SWB
  C131 C134 C138 C583 C628 C632 C636: ClassName: SWA
  C132 C136 C574 C585 C630 C634 C638: ClassName: SWC
  C133 C137 C582 C627 C631 C635 C639: ClassName: SWE
  C640 C642 C644 C646 C648 C650 C652: ClassName: SWF
  C641 C643 C645 C647 C649 C651 C653: ClassName: SWG
  C655 C657 C659 C661 C663: ClassName: SWH
  C656 C658 C660 C662 C664: ClassName: SWM
  C673 C677 C685 C689 C693: ClassName: SWL
  C674 C678 C686 C690 C694: ClassName: SWJ
  C675 C679 C687 C691 C695: ClassName: SWI
  C676 C680 C688 C692 C696: ClassName: SWK
  C698 C699 C701-C703: ClassName: SWN
  C704-C710: ClassName: SWD
C665-C672 C681-C684 C697 C700 = CK45-14100: Approved: CL; NoLoad: .; MFGR: VENKEL; M_PN: C0603X7R500-104JNE; level: 1; line_number: 65; G_PN: CK45-14100; ModifyDate: 3/29/13; item_number: CK45-14100
  C665 C667: ClassName: SWH
  C666 C668: ClassName: SWM
  C669 C681: ClassName: SWL
  C670 C682: ClassName: SWJ
  C671 C683: ClassName: SWI
  C672 C684: ClassName: SWK
  C697 C700: ClassName: SWN
FT4 FT8 FT35 = FromToNode: level: 1; Approved: *; G_PN: *; MFGR: *; Value: *
R109-R111 R116 R126-R129 R134 R135 R146 R147 = RK40-01300: NoLoad: .; MFGR: VENKEL; M_PN: CR0603-10W-1300FT; Approved: CL; level: 1; line_number: 665; ModifyDate: 3/27/13; G_PN: RK40-01300; item_number: RK40-01300
  R109 R126: ClassName: SWA
  R110 R127: ClassName: SWB
  R111 R128: ClassName: SWC
  R116 R129: ClassName: SWF
  R134 R146: ClassName: SWE
  R135 R147: ClassName: SWG
R117 R119-R125 R138 R139 R142 R143 = RK40-00000: NoLoad: .; MFGR: ANY; Approved: CL; level: 1; line_number: 710; ModifyDate: 3/27/13; M_PN: ANY; G_PN: RK40-00000; item_number: RK40-00000
  R117 R122: ClassName: SWA
  R119 R123: ClassName: SWB
  R120 R124: ClassName: SWC
  R121 R125: ClassName: SWF
  R138 R142: ClassName: SWE
  R139 R143: ClassName: SWG
R130 R144 R148-R151 R160-R163 = RK41-01400: NoLoad: .; MFGR: VENKEL; M_PN: CR0603-10W-1300FT; Approved: CL; level: 1; line_number: 690; ModifyDate: 3/27/13; G_PN: RK41-01400; item_number: RK41-01400
  R130 R144: ClassName: SWH
  R148 R160: ClassName: SWL
  R149 R161: ClassName: SWJ
  R150 R162: ClassName: SWI
  R151 R163: ClassName: SWK
R132 R145 R246 R249 R349 R367 = RK35-01400: NoLoad: .; MFGR: ANY; Approved: CL; level: 1; line_number: 975; ModifyDate: 4/11/12; M_PN: ANY; G_PN: RK35-01400; item_number: RK35-01400
  R132 R249: ClassName: SWN
  R145 R246: ClassName: SWM
  R349 R367: ClassName: SWD
R136 R137 R140 R141 R152-R159 R247 R248 R365 R366 = RK35-00000: NoLoad: .; MFGR: ANY; Approved: CL; level: 1; line_number: 1005; ModifyDate: 02/22/12; M_PN: ANY; G_PN: RK35-00000; item_number: RK35-00000
  R136 R140: ClassName: SWH
  R137 R141: ClassName: SWM
  R152 R156: ClassName: SWL
  R153 R157: ClassName: SWJ
  R154 R158: ClassName: SWI
  R155 R159: ClassName: SWK
  R247 R248: ClassName: SWN
  R365 R366: ClassName: SWD
SW3-SW14 SW22 SW24 = ULD0-00613_1: QUAD SPST ANALOG SW;200NS;45 OHM;SO-16; Value: DG613DY; MFGR: VISHAY; NoLoad: .; Approved: NM; level: 1; line_number: 1060; ModifyDate: 2/20/13; M_PN: DG613DY; item_number: ULD0-00613
SW301-1-SW301-6 SW302-1-SW302-6 SW303-1-SW303-6 SW304-1-SW304-5 T18-T33 T41 T42 T45 T46 T62 T63 T73-T76 T80-T83 = JIB0-11254: SOCKET;SINGLE;.018-.040 ID X .254;OPEN;GLD; NoLoad: .; MFGR: AMP; Approved: NM; M_PN: 380635; level: 1; line_number: 1065; ModifyDate: 11/30/12; G_PN: JIB0-11254; item_number: JIB0-11254
SW304-6 = JIB0-11254_Trim: SOCKET;SINGLE;.018-.040 ID X .254;OPEN;GLD; NoLoad: .; MFGR: AMP; M_PN: 380635; level: 1; line_number: 1065; ModifyDate: 11/30/12; item_number: JIB0-11254
TP21-TP48 = TP-060: Approved: NM; level: 1; MFGR: N/A; M_PN: N/A

## Sheet 200MHz_Comb_Gen_Driver.SchDoc: 200MHz_Comb_Gen_Driver
size D; Date: 09-24-10; DrawnBy: C. Lewis; Engineer: C. Lewis; Address1: 4650 NORRIS CANYON RD.; Address2: SAN RAMON, CA 94583; DocumentNumber: 35133; Revision: D; SheetNumber: 10; SheetTotal: 20; PageSetup: Record=PageOptions|CenterHorizontal=True|CenterVertical=True|PrintScale=0.51|XCorrection=1.00|YCorrection=1.00|PrintKind=1|BorderSize=5000000|LeftOffset=0|BottomOffset=0|Orientation=2|PaperLength=1000|PaperWidth=1000|Scale=100|PaperSource=15|PrintQuality=600|MediaType=1|DitherType=10|PaperKind=11x17|PrintScaleMode=1; DocumentName: Sheet1.SCHDOC; ModifiedDate: 10-27-11
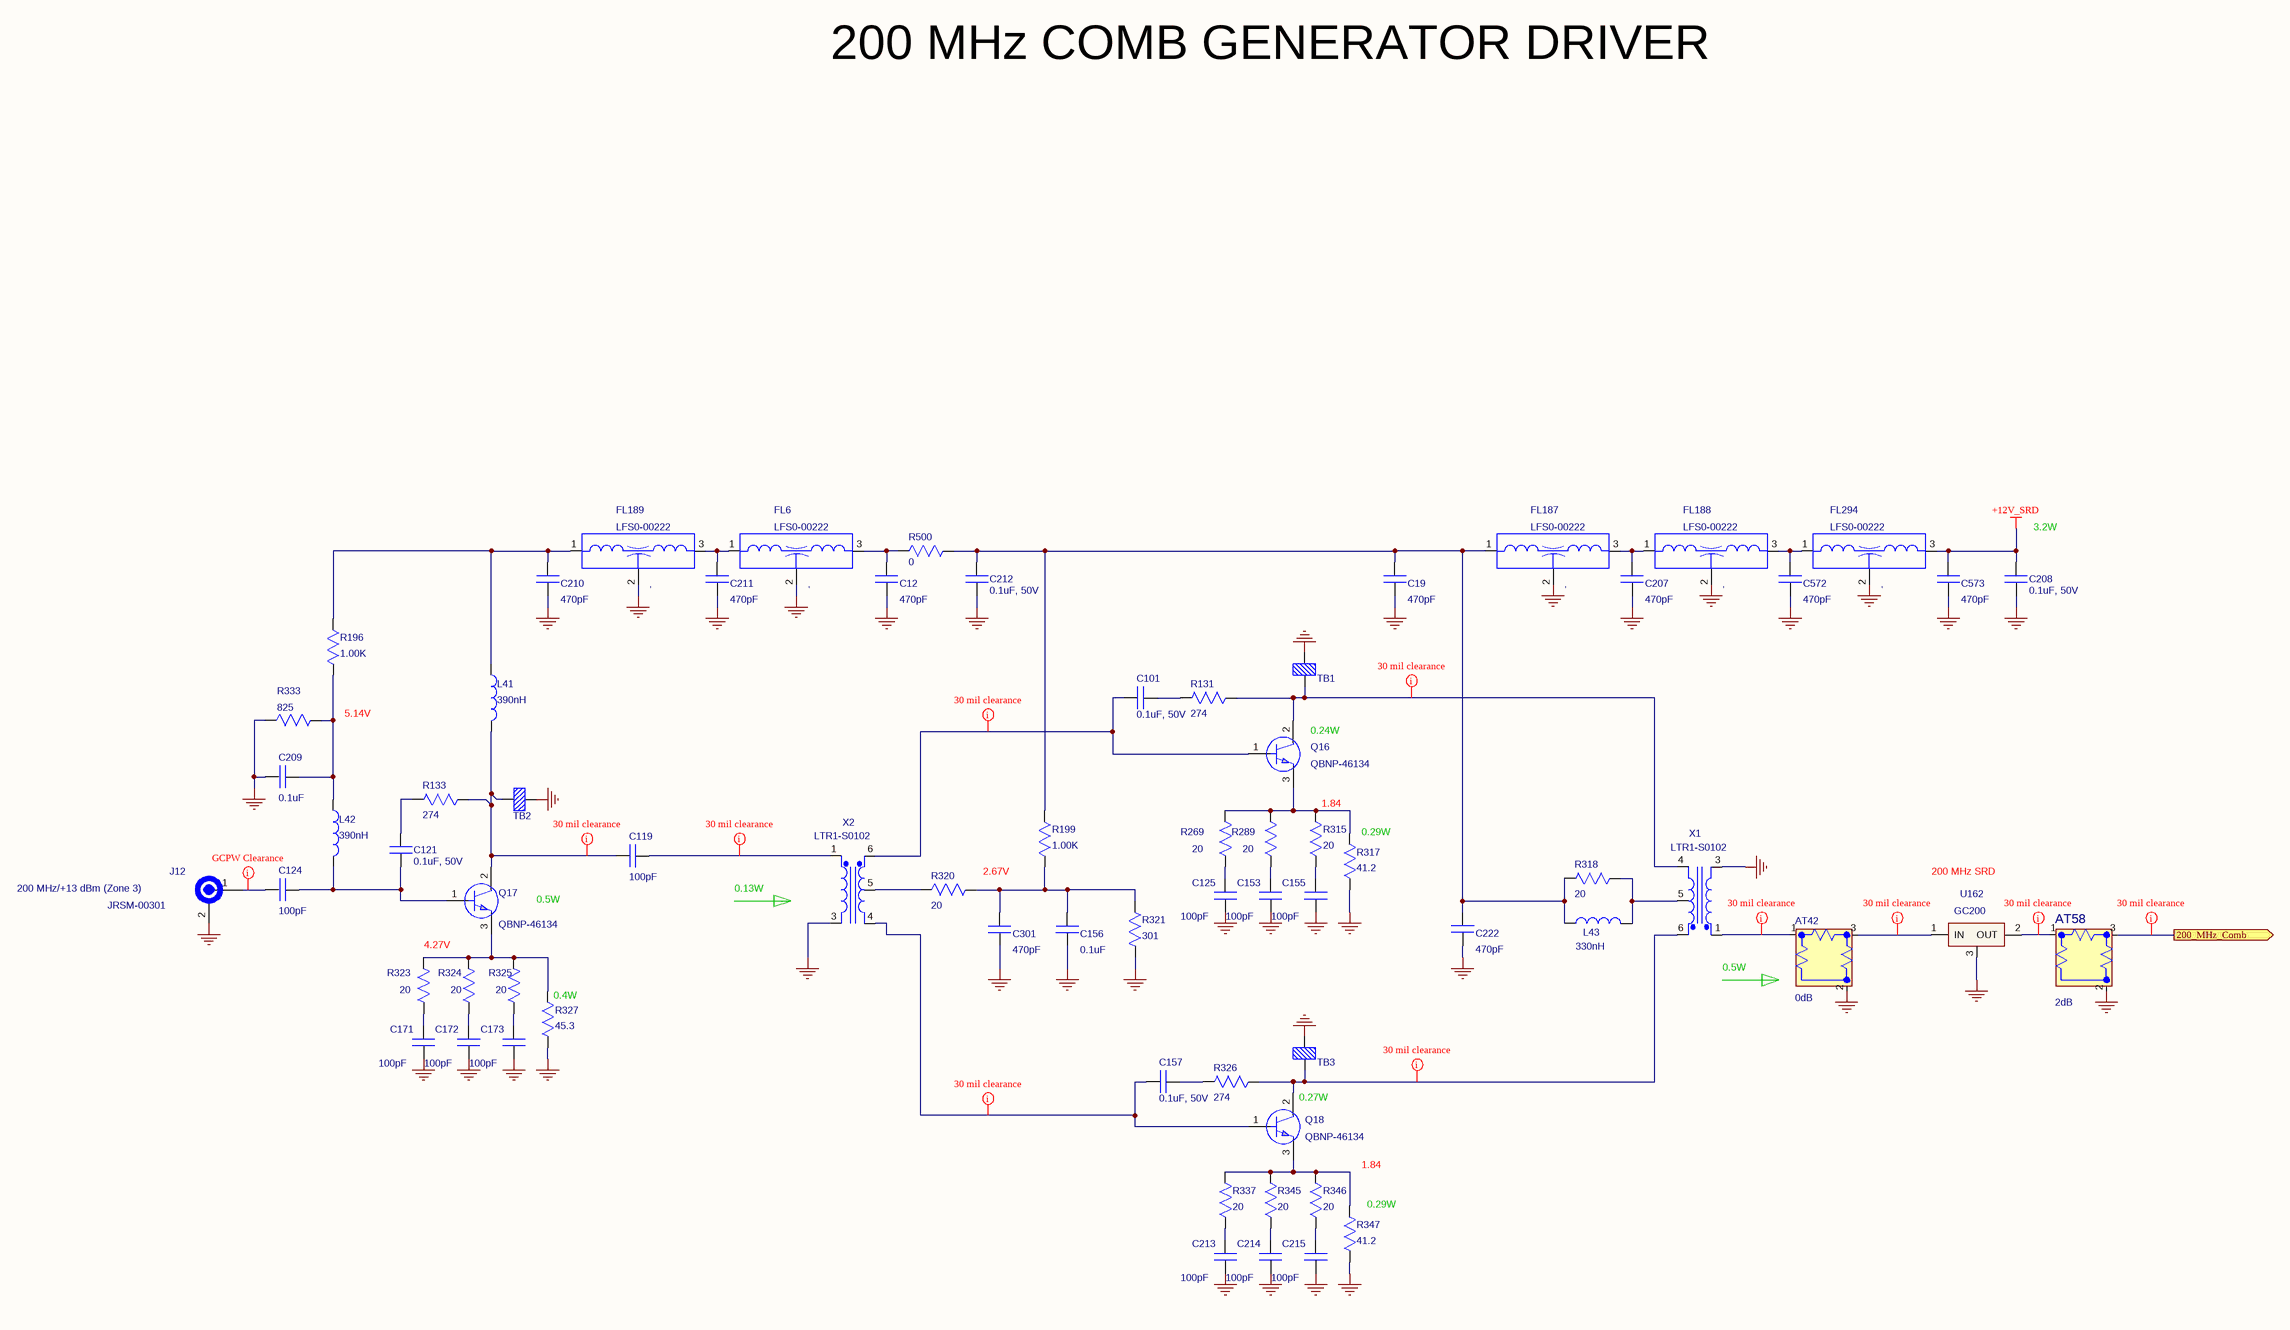
[diagram p37: 200MHz_Comb_Gen_Driver.SchDoc]

### Parts
AT42  value 0dB  [ATTN-IMS-0805]  (hidden comment: PAD;CHIP;0dB;+/-.3dB;.08 x .05;50 OHM;FACE DOWN)
AT58  value 2dB  [ATTN-IMS-0805]  (hidden comment: PAD;CHIP;2dB;+/-.3dB;.08 x .05;50 OHM;FACE DOWN)
C12  value 470pF  [CAP-0402-N]  (hidden comment: 470 PF;5%;COG;>50V;CHIP;0402)
C19  value 470pF  [CAP-0402-N]  (hidden comment: 470 PF;5%;COG;>50V;CHIP;0402)
C101  value 0.1uF, 50V  [CAP-0603-N]  (hidden comment: .1UF;5%;X7R;50V;CHIP;0603)
C119  value 100pF  [CAP-0402-N]  (hidden comment: 100 PF;5%;COG;>50V;CHIP;0402)
C121  value 0.1uF, 50V  [CAP-0603-N]  (hidden comment: .1UF;5%;X7R;50V;CHIP;0603)
C124  value 100pF  [CAP-0402-N]  (hidden comment: 100 PF;5%;COG;>50V;CHIP;0402)
C125  value 100pF  [CAP-0402-N]  (hidden comment: 100 PF;5%;COG;>50V;CHIP;0402)
C153  value 100pF  [CAP-0402-N]  (hidden comment: 100 PF;5%;COG;>50V;CHIP;0402)
C155  value 100pF  [CAP-0402-N]  (hidden comment: 100 PF;5%;COG;>50V;CHIP;0402)
C156  value 0.1uF  [CAP-0402-N]  (hidden comment: .1 UF,10%;X7R;16V,CHIP;0402)
C157  value 0.1uF, 50V  [CAP-0603-N]  (hidden comment: .1UF;5%;X7R;50V;CHIP;0603)
C171  value 100pF  [CAP-0402-N]  (hidden comment: 100 PF;5%;COG;>50V;CHIP;0402)
C172  value 100pF  [CAP-0402-N]  (hidden comment: 100 PF;5%;COG;>50V;CHIP;0402)
C173  value 100pF  [CAP-0402-N]  (hidden comment: 100 PF;5%;COG;>50V;CHIP;0402)
C207  value 470pF  [CAP-0402-N]  (hidden comment: 470 PF;5%;COG;>50V;CHIP;0402)
C208  value 0.1uF, 50V  [CAP-0603-N]  (hidden comment: .1UF;5%;X7R;50V;CHIP;0603)
C209  value 0.1uF  [CAP-0402-N]  (hidden comment: .1 UF,10%;X7R;16V,CHIP;0402)
C210  value 470pF  [CAP-0402-N]  (hidden comment: 470 PF;5%;COG;>50V;CHIP;0402)
C211  value 470pF  [CAP-0402-N]  (hidden comment: 470 PF;5%;COG;>50V;CHIP;0402)
C212  value 0.1uF, 50V  [CAP-0603-N]  (hidden comment: .1UF;5%;X7R;50V;CHIP;0603)
C213  value 100pF  [CAP-0402-N]  (hidden comment: 100 PF;5%;COG;>50V;CHIP;0402)
C214  value 100pF  [CAP-0402-N]  (hidden comment: 100 PF;5%;COG;>50V;CHIP;0402)
C215  value 100pF  [CAP-0402-N]  (hidden comment: 100 PF;5%;COG;>50V;CHIP;0402)
C222  value 470pF  [CAP-0402-N]  (hidden comment: 470 PF;5%;COG;>50V;CHIP;0402)
C301  value 470pF  [CAP-0402-N]  (hidden comment: 470 PF;5%;COG;>50V;CHIP;0402)
C572  value 470pF  [CAP-0402-N]  (hidden comment: 470 PF;5%;COG;>50V;CHIP;0402)
C573  value 470pF  [CAP-0402-N]  (hidden comment: 470 PF;5%;COG;>50V;CHIP;0402)
FL6  Filter EMI 2200PF,1206  [FIL-NFE31P-1206-4P]  (value not drawn)
FL187  Filter EMI 2200PF,1206  [FIL-NFE31P-1206-4P]  (value not drawn)
FL188  Filter EMI 2200PF,1206  [FIL-NFE31P-1206-4P]  (value not drawn)
FL189  Filter EMI 2200PF,1206  [FIL-NFE31P-1206-4P]  (value not drawn)
FL294  Filter EMI 2200PF,1206  [FIL-NFE31P-1206-4P]  (value not drawn)
J12  200 MHz/+13 dBm (Zone 3)  [CONN-3211-60035_plane_cutout]
L41  value 390nH  [IND-0603CS]  (hidden comment: INDUCTOR;390NH;5%;.78GHZ SRF;25Q;4.35 DCR;100MA;WIREWOUND;0603)
L42  value 390nH  [IND-0603CS]  (hidden comment: INDUCTOR;390NH;5%;.78GHZ SRF;25Q;4.35 DCR;100MA;WIREWOUND;0603)
L43  value 330nH  [IND-1008CS]  (hidden comment: INDUCTOR;.33 UH;5%;570 MHZ SRF;45Q @100MHZ;1.05 DCR;450MA;WIREWOUND;1008)
Q16  .  [SOT89-3N]  (value not drawn)
Q17  .  [SOT89-3N]  (value not drawn)
Q18  .  [SOT89-3N]  (value not drawn)
R131  value 274  [RES-0402-N]  (hidden comment: 274 OHMS; 1%; .1W; 100PPM; FILM; CHIP; 0402)
R133  value 274  [RES-0402-N]  (hidden comment: 274 OHMS; 1%; .1W; 100PPM; FILM; CHIP; 0402)
R196  value 1.00K  [RES-0402-N]  (hidden comment: 1.0K OHMS;.06W;1%;200PPM;FILM;CHIP;0402)
R199  value 1.00K  [RES-0402-N]  (hidden comment: 1.0K OHMS;.06W;1%;200PPM;FILM;CHIP;0402)
R269  value 20  [RES-0402-N]  (hidden comment: 20 OHMS;.06W;1%;200PPM;FILM;CHIP;0402)
R289  value 20  [RES-0402-N]  (hidden comment: 20 OHMS;.06W;1%;200PPM;FILM;CHIP;0402)
R315  value 20  [RES-0402-N]  (hidden comment: 20 OHMS;.06W;1%;200PPM;FILM;CHIP;0402)
R317  value 41.2  [RES-2010-N]  (hidden comment: 41.2 OHMS;.75W;1%;100PPM;THICK FILM;CHIP;2010;RoHS)
R318  value 20  [RES-0402-N]  (hidden comment: 20 OHMS;.06W;1%;200PPM;FILM;CHIP;0402)
R320  value 20  [RES-0402-N]  (hidden comment: 20 OHMS;.06W;1%;200PPM;FILM;CHIP;0402)
R321  value 301  [RES-0402-N]  (hidden comment: 301 OHMS; 1%; .1W; 100PPM; FILM; CHIP; 0402)
R323  value 20  [RES-0402-N]  (hidden comment: 20 OHMS;.06W;1%;200PPM;FILM;CHIP;0402)
R324  value 20  [RES-0402-N]  (hidden comment: 20 OHMS;.06W;1%;200PPM;FILM;CHIP;0402)
R325  value 20  [RES-0402-N]  (hidden comment: 20 OHMS;.06W;1%;200PPM;FILM;CHIP;0402)
R326  value 274  [RES-0402-N]  (hidden comment: 274 OHMS; 1%; .1W; 100PPM; FILM; CHIP; 0402)
R327  value 45.3  [RES-2010-N]  (hidden comment: 45.3 OHMS;0.75W;1%;100PPM;THICK FILM;CHIP;2010;RoHS)
R333  value 825  [RES-0402-N]  (hidden comment: 825 OHMS; 1%; .1W; 100PPM; FILM; CHIP; 0402)
R337  value 20  [RES-0402-N]  (hidden comment: 20 OHMS;.06W;1%;200PPM;FILM;CHIP;0402)
R345  value 20  [RES-0402-N]  (hidden comment: 20 OHMS;.06W;1%;200PPM;FILM;CHIP;0402)
R346  value 20  [RES-0402-N]  (hidden comment: 20 OHMS;.06W;1%;200PPM;FILM;CHIP;0402)
R347  value 41.2  [RES-2010-N]  (hidden comment: 41.2 OHMS;.75W;1%;100PPM;THICK FILM;CHIP;2010;RoHS)
R500  value 0  [RES-0402-N]  (hidden comment: JUMPER;0 OHMS;SMT;0402)
TB1  THERMAL BRIDGE, AlN, 1010  [TB-1010-N]  (value not drawn)
TB2  THERMAL BRIDGE, AlN, 1010  [TB-1010-N]  (value not drawn)
TB3  THERMAL BRIDGE, AlN, 1010  [TB-1010-N]  (value not drawn)
U162  M_PN: GC200  [DIO-GC-OUTLINE-L]  (hidden comment: DIODE;SRD;COAXIAL;200MHz COM GEN)
X1  XFORMER;1:2Z CT;8-600 MHZ;1W;30MA;CD542 CASE  [XFMR-CD542]  (value not drawn)
X2  XFORMER;1:2Z CT;8-600 MHZ;1W;30MA;CD542 CASE  [XFMR-CD542]  (value not drawn)

### Ports
200_MHz_Comb

### Nets
+12V_SRD: C208.1 C573.1 FL294.3(OUT)
GND: AT42.2(GND) AT58.2(GND) C12.2 C19.2 C125.1 C153.1 C155.1 C156.1 C171.1 C172.1 C173.1 C207.2 C208.2 C209.2 C210.2 C211.2 C212.2 C213.1 C214.1 C215.1 C222.2 C301.1 C572.2 C573.2 FL6.2(GND) FL187.2(GND) FL188.2(GND) FL189.2(GND) FL294.2(GND) J12.2(GND) R317.2 R321.1 R327.2 R333.2 R347.2 TB1.2 TB2.2 TB3.2 U162.3(GND) X1.3(Pri-) X2.3(Pri-)
NetAT42_1: AT42.1(IN/OUT) X1.1(Pri+)
NetAT42_3: AT42.3(IN/OUT) U162.1(IN)
NetAT58_1: AT58.1(IN/OUT) U162.2(OUT)
NetAT58_3: AT58.3(IN/OUT) ; port 200_MHz_Comb
NetC12_1: C12.1 FL6.3(OUT) R500.2
NetC19_1: C19.1 C212.1 C222.1 FL187.1(IN) L43.1 R199.2 R318.1 R500.1
NetC101_1: C101.1 Q16.1(BASE) X2.6(Sec+)
NetC101_2: C101.2 R131.1
NetC119_1: C119.1 X2.1(Pri+)
NetC119_2: C119.2 L41.2 Q17.2(COLLECTOR) R133.2 TB2.1
NetC121_1: C121.1 R133.1
NetC121_2: C121.2 C124.1 L42.2 Q17.1(BASE)
NetC124_2: C124.2 J12.1
NetC125_2: C125.2 R269.2
NetC153_2: C153.2 R289.2
NetC155_2: C155.2 R315.2
NetC156_2: C156.2 C301.2 R199.1 R320.1 R321.2
NetC157_1: C157.1 Q18.1(BASE) X2.4(Sec-)
NetC157_2: C157.2 R326.1
NetC171_2: C171.2 R323.2
NetC172_2: C172.2 R324.2
NetC173_2: C173.2 R325.2
NetC207_1: C207.1 FL187.3(OUT) FL188.1(IN)
NetC209_1: C209.1 L42.1 R196.1 R333.1
NetC210_1: C210.1 FL189.1(IN) L41.1 R196.2
NetC211_1: C211.1 FL6.1(IN) FL189.3(OUT)
NetC213_2: C213.2 R337.2
NetC214_2: C214.2 R345.2
NetC215_2: C215.2 R346.2
NetC572_1: C572.1 FL188.3(OUT) FL294.1(IN)
NetL43_2: L43.2 R318.2 X1.5(SecCT)
NetQ16_2: Q16.2(COLLECTOR) R131.2 TB1.1 X1.4(Sec-)
NetQ16_3: Q16.3(EMITTER) R269.1 R289.1 R315.1 R317.1
NetQ17_3: Q17.3(EMITTER) R323.1 R324.1 R325.1 R327.1
NetQ18_2: Q18.2(COLLECTOR) R326.2 TB3.1 X1.6(Sec+)
NetQ18_3: Q18.3(EMITTER) R337.1 R345.1 R346.1 R347.1
NetR320_2: R320.2 X2.5(SecCT)

### Layout directives
net class 30 mil clearance: NetAT42_1, NetAT42_3, NetAT58_1, NetAT58_3, NetC101_1, NetC119_1, NetC119_2, NetC157_1, NetQ16_2, NetQ18_2
net class GCPW Clearance: NetC124_2

### Notes on the sheet
- 200 MHz COMB GENERATOR DRIVER
- (near C208) 3.2W
- 5.14V
- (near Q16) 0.24W
- (near R315) 1.84
- (near R320) 2.67V
- (near R317) 0.29W
- 200 MHz SRD
- 0.5W
- 0.13W
- 4.27V
- (near X1) 0.5W
- (near R327) 0.4W
- (near Q18) 0.27W
- 1.84
- (near R347) 0.29W
- Title
- Sheet Title
- PRINTED DOCUMENT IS CONSIDERED UNCONTROLLED. VERIFY REVISION IN PLM SYSTEM.
- THIS DOCUMENT CONTAINS PROPRIETARY INFORMATION. DESIGN RIGHTS BELONG TO GIGA-TRONICS AND MAY NOT BE REPRODUCED WITHOUT WRITTEN AUTHORIZATION FOR ANY REASON EXCEPT CALIBRATION, OPERATION AND MAINTENANCE.
- Size
- CAGE CODE
- Filename
- D
- Document Number
- 58900
- Date
- Sheet
- Rev
- of
- (in symbol LFS0-00222) ,

### Library data of the parts
AT42 = MPFC-A1000: NoLoad: .; Approved: CL; M_PN: IMS1141-00DB; MFGR: IMS RESISTORS; level: 1; line_number: 50; ModifyDate: 4/16/13; G_PN: MPFC-A1000; item_number: MPFC-A1000
AT58 = MPFC-A1002: NoLoad: .; Approved: CL; M_PN: IMS1141-02DB; MFGR: IMS RESISTORS; level: 1; line_number: 10; ModifyDate: 3/8/13; G_PN: MPFC-A1002; item_number: MPFC-A1002
C12 C19 C210 C211 = CK40-01470: Approved: CL; MFGR: Any; NoLoad: .; level: 1; line_number: 75; ModifyDate: 02/22/12; G_PN: CK40-01470; M_PN: Any; item_number: CK40-01470
C101 C121 C157 C212 = CK45-14100: as C665-C672 on sheet A1-A1 Switches new; G_PN: CK45-14100; ModifyDate: 3/29/13; item_number: CK45-14100
C119 C124 C125 C153 C155 C171-C173 C213-C215 = CK40-01100: MFGR: Any; Approved: CL; NoLoad: .; level: 1; line_number: 70; ModifyDate: 3/21/12; M_PN: Any; G_PN: CK40-01100; item_number: CK40-01100
C156 C209 = CK40-04100: as C130-C138 on sheet A1-A1 Switches new; G_PN: CK40-04100; ModifyDate: 3/29/13; item_number: CK40-04100
C207 C222 C572 C573 = CK40-01470: Approved: CL; NoLoad: .; MFGR: Any; level: 1; line_number: 75; G_PN: CK40-01470; ModifyDate: 02/22/12; M_PN: Any; item_number: CK40-01470
C208 = CK45-14100: Approved: CL; NoLoad: .; M_PN: C0603X7R500-104JNE; MFGR: VENKEL; level: 1; line_number: 65; ModifyDate: 3/29/13; G_PN: CK45-14100; item_number: CK45-14100
C301 = CK40-01470: MFGR: Any; Approved: CL; NoLoad: .; level: 1; line_number: 75; ModifyDate: 02/22/12; M_PN: Any; G_PN: CK40-01470; item_number: CK40-01470
FL6 FL187-FL189 FL294 = LFS0-00222: Approved: CL; NoLoad: .; M_PN: NFE31PT222Z1E9BL; MFGR: MURATA; level: 1; line_number: 335; G_PN: LFS0-00222; ModifyDate: 02/22/12; Value: 2200pF; item_number: LFS0-00222
J12 = JRSM-00301: SMPM;SB EDGE LAUNCH;MALE;1 PORT; Value: 3211-60035; MFGR: SV MICROWAVE; Approved: CL; NoLoad: .; level: 1; line_number: 485; M_PN: 3211-60035; ModifyDate: 5/14/12; G_PN: JRSM-00301; item_number: JRSM-00301
L41 L42 = LSA3-04390: M_PN: 0603CS-R39XJLU; NoLoad: .; Approved: CL; MFGR: COILCRAFT; level: 1; line_number: 580; G_PN: LSA3-04390; ModifyDate: 02/22/12; item_number: LSA3-04390
L43 = LSA1-04330: M_PN: 1008CS-331XJLB; NoLoad: .; Approved: CL; MFGR: COILCRAFT; level: 1; line_number: 585; G_PN: LSA1-04330; ModifyDate: 02/22/12; item_number: LSA1-04330
Q16-Q18 = QBNP-46134: 27.5 dBm @1GHz;5.5 GHz fT;15V MAX;250 mA MAX;SOT-89; Value: MMBR941LT1; MFGR: CEL; Approved: NM; M_PN: NE46134; level: 1; line_number: 635; G_PN: QBNP-46134; NoLoad: .; ModifyDate: 11/28/12; item_number: QBNP-46134
R131 R133 R326 = RK35-02740: Approved: CL; NoLoad: .; MFGR: ANY; level: 1; line_number: 695; G_PN: RK35-02740; ModifyDate: 6/28/13; M_PN: ANY; item_number: RK35-02740
R196 R199 = RK35-11000: NoLoad: .; MFGR: ANY; Approved: CL; level: 1; line_number: 1025; ModifyDate: 02/22/12; M_PN: ANY; G_PN: RK35-11000; item_number: RK35-11000
R269 R289 R315 R320 R323-R325 R337 R345 R346 = RK35-00200: NoLoad: .; Approved: CL; MFGR: ANY; level: 1; line_number: 780; G_PN: RK35-00200; ModifyDate: 02/22/12; M_PN: ANY; item_number: RK35-00200
R317 R347 = RK65-00412: NoLoad: .; M_PN: CRCW201041R2FKEF; MFGR: VISHAY/DALE; Approved: CL; level: 1; line_number: 830; G_PN: RK65-00412; ModifyDate: 3/18/12; item_number: RK65-00412
R318 = RK35-00200: Approved: CL; NoLoad: .; MFGR: ANY; level: 1; line_number: 780; G_PN: RK35-00200; ModifyDate: 02/22/12; M_PN: ANY; item_number: RK35-00200
R321 = RK35-03010: Approved: CL; NoLoad: .; MFGR: ANY; level: 1; line_number: 835; ModifyDate: 4/12/12; G_PN: RK35-03010; M_PN: ANY; item_number: RK35-03010
R327 = RK65-00453: NoLoad: .; M_PN: CRCW201045R3FKEF; MFGR: VISHAY/DALE; Approved: CL; level: 1; line_number: 890; G_PN: RK65-00453; ModifyDate: 02/22/12; item_number: RK65-00453
R333 = RK35-08250: Approved: CL; NoLoad: .; MFGR: ANY; level: 1; line_number: 855; ModifyDate: 02/22/12; G_PN: RK35-08250; M_PN: ANY; item_number: RK35-08250
R500 = RK35-00000: NoLoad: .; Approved: CL; MFGR: ANY; level: 1; line_number: 1005; G_PN: RK35-00000; ModifyDate: 02/22/12; M_PN: ANY; item_number: RK35-00000
TB1-TB3 = BK51-00000: Approved: CL; NoLoad: .; MFGR: ANY; M_PN: BT31010WA; level: 1; line_number: 1090; G_PN: BK51-00000; ModifyDate: 6-28-13; Value: N/A; item_number: BK51-00000
U162 = DIA0-00200: Approved: NM; NoLoad: .; MFGR: HEROTEK; level: 1; line_number: 1140; G_PN: DIA0-00200; ModifyDate: 1/23/2013; item_number: DIA0-00200
X1 X2 = LTR1-S0102: M_PN: ADT2-1T-1P+; NoLoad: .; MFGR: MINICIRCUITS; Approved: NM; Value: ADT2-1T-1P+; level: 1; line_number: 1070; ModifyDate: 11/9/12; G_PN: LTR1-S0102; item_number: LTR1-S0102